# Altium project Enigma Rev A.PrjPCB (part 1 of 10)
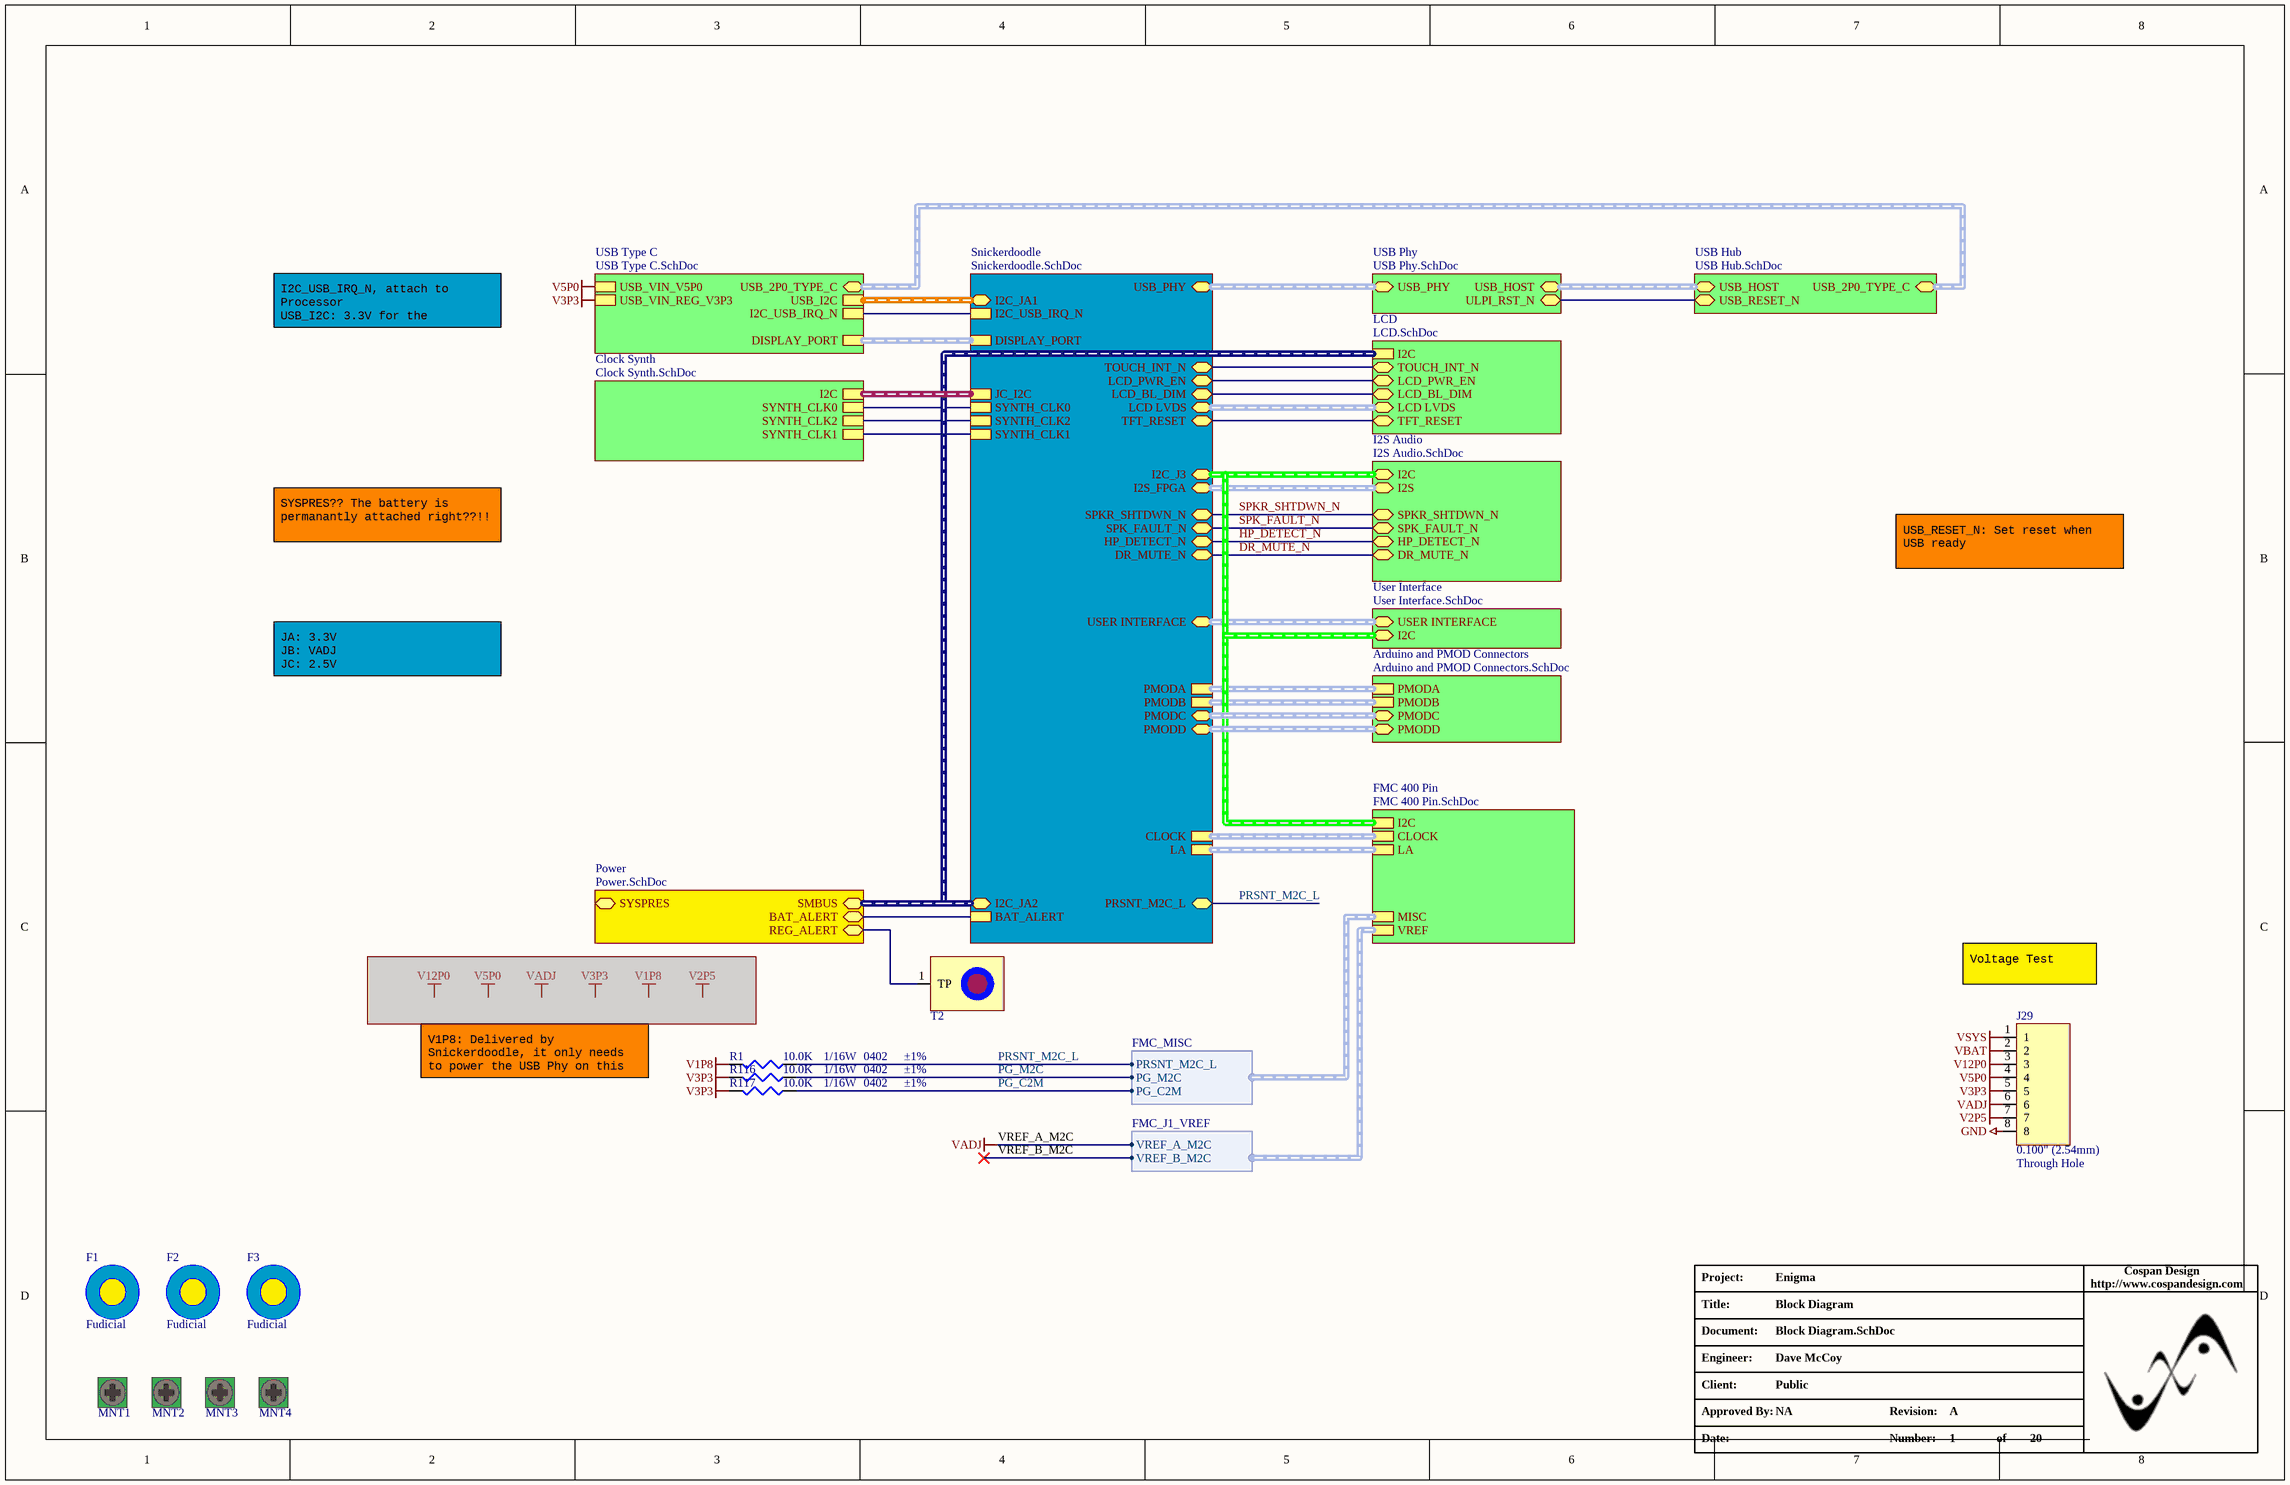
[diagram p0: Block Diagram.SchDoc]
Company: Cospan Design LLC; DrawnBy: Dave McCoy; Engineer: Dave McCoy; Project: Enigma; Revision: A
20 sheets, 563 parts. Net scope: hierarchical (ports join the sheet entries above them; power ports are global).
Board file: Enigma Rev A.PcbDoc
Sheets:
  Block Diagram.SchDoc
    Arduino and PMOD Connectors = Arduino and PMOD Connectors.SchDoc
    User Interface = User Interface.SchDoc
    Snickerdoodle = Snickerdoodle.SchDoc
      Snickerdoodle PS = Snickerdoodle PS.SchDoc
      Snickerdoodle FPGA JA = Snickerdoodle FPGA JA.SchDoc
      Snickerdoodle FPGA JB = Snickerdoodle FPGA JB.SchDoc
      Snickerdoodle FPGA JC = Snickerdoodle FPGA JC.SchDoc
    LCD = LCD.SchDoc
    USB Type C = USB Type C.SchDoc
      USB Type C Connector ESD.SchDoc = USB Type C Connector ESD.SchDoc
    USB Hub = USB Hub.SchDoc
    I2S Audio = I2S Audio.SchDoc
    USB Phy = USB Phy.SchDoc
    FMC 400 Pin = FMC 400 Pin.SchDoc
    Power = Power.SchDoc
      Battery Manager = Battery Manager.SchDoc
      Power V12P0 = Power V12P0.SchDoc
      Power Main Regulators = Power Main Regulators.SchDoc
    Clock Synth = Clock Synth.SchDoc

## Sheet Block Diagram.SchDoc: Block Diagram
size Tabloid; ApprovedBy: NA; CompanyName: Cospan Design LLC; DrawnBy: Dave McCoy; Engineer: Dave McCoy; DocumentNumber: 1; Revision: A; SheetNumber: 1; SheetTotal: 20; Client: Public; Project: Enigma; ProjectPrettyName: Enigma

### Parts
F1  Fudicial  [FIDUCIAL ROUND]  (no BOM)
F2  Fudicial  [FIDUCIAL ROUND]  (no BOM)
F3  Fudicial  [FIDUCIAL ROUND]  (no BOM)
J29  Pitch: 0.100" (2.54mm)  Mounting Type: Through Hole  [HDR_1X8 - FEMALE]  (hidden comment: J_HDR1X8_THRHOLE_VERT_RECPT)
MNT1  Mounting Hole  [MNT_4-40]  (value not drawn)  (no BOM)
MNT2  Mounting Hole  [MNT_4-40]  (value not drawn)  (no BOM)
MNT3  Mounting Hole  [MNT_4-40]  (value not drawn)  (no BOM)
MNT4  Mounting Hole  [MNT_4-40]  (value not drawn)  (no BOM)
R1  Resistance In Ohms: 10.0K  Power (Watts): 1/16W  Case: 0402  Tolerance: ±1%  [R_0402]  (hidden comment: R_0402_10.0K)
R116  Resistance In Ohms: 10.0K  Power (Watts): 1/16W  Case: 0402  Tolerance: ±1%  [R_0402]  (hidden comment: R_0402_10.0K)
R117  Resistance In Ohms: 10.0K  Power (Watts): 1/16W  Case: 0402  Tolerance: ±1%  [R_0402]  (hidden comment: R_0402_10.0K)
T2  TEST_POINT_SMALL  [TestPointSmall]  (value not drawn)  (no BOM)

### Sub-sheets
Arduino and PMOD Connectors = Arduino and PMOD Connectors.SchDoc: PMODA (harness PMOD_Harness), PMODB (harness PMOD_Harness), PMODC (harness PMOD_Harness), PMODD (harness PMOD_Harness)
Clock Synth = Clock Synth.SchDoc: I2C (harness I2C Harness), SYNTH_CLK0, SYNTH_CLK2, SYNTH_CLK1
FMC 400 Pin = FMC 400 Pin.SchDoc: LA (harness FMC_J1_LA), MISC (harness FMC_MISC), I2C (harness I2C Harness), CLOCK (harness FMC_J1_CLOCK), VREF (harness FMC_J1_VREF)
I2S Audio = I2S Audio.SchDoc: SPKR_SHTDWN_N, I2C (harness I2C Harness), I2S (harness I2S Harness), DR_MUTE_N, SPK_FAULT_N, HP_DETECT_N
LCD = LCD.SchDoc: LCD LVDS (harness LCD Harness), TFT_RESET, I2C (harness I2C Harness), LCD_PWR_EN, LCD_BL_DIM, TOUCH_INT_N
Power = Power.SchDoc: SMBUS (harness I2C Harness), SYSPRES, BAT_ALERT, REG_ALERT
Snickerdoodle = Snickerdoodle.SchDoc: I2S_FPGA (harness I2S Harness), SPKR_SHTDWN_N, DR_MUTE_N, SPK_FAULT_N, HP_DETECT_N, USB_PHY (harness USB Phy Harness), I2C_USB_IRQ_N, DISPLAY_PORT (harness Display Port), USER INTERFACE (harness User Interface Harness), PMODA (harness PMOD_Harness), PMODB (harness PMOD_Harness), BAT_ALERT, LA (harness FMC_J1_LA), CLOCK (harness FMC_J1_CLOCK), PMODC (harness PMOD_Harness), PMODD (harness PMOD_Harness), SYNTH_CLK0, SYNTH_CLK2, SYNTH_CLK1, JC_I2C (harness I2C Harness), I2C_JA1 (harness I2C Harness), LCD LVDS (harness LCD Harness), I2C_J3 (harness I2C Harness), I2C_JA2 (harness I2C Harness), TFT_RESET, LCD_PWR_EN, LCD_BL_DIM, TOUCH_INT_N, PRSNT_M2C_L
USB Hub = USB Hub.SchDoc: USB_HOST (harness USB Harness), USB_RESET_N, USB_2P0_TYPE_C (harness USB Harness)
USB Phy = USB Phy.SchDoc: USB_PHY (harness USB Phy Harness), USB_HOST (harness USB Harness), ULPI_RST_N
USB Type C = USB Type C.SchDoc: I2C_USB_IRQ_N, USB_VIN_REG_V3P3, DISPLAY_PORT (harness Display Port), USB_VIN_V5P0, USB_I2C (harness I2C Harness), USB_2P0_TYPE_C (harness USB Harness)
User Interface = User Interface.SchDoc: USER INTERFACE (harness User Interface Harness), I2C (harness I2C Harness)

### Harnesses
FMC_J1_VREF: VREF_A_M2C, VREF_B_M2C
FMC_MISC: PRSNT_M2C_L, PG_M2C, PG_C2M

### Nets
GND: J29.8
V1P8: R1.1
V2P5: J29.7
V3P3: J29.5 R116.1 R117.1 ; sheet USB Type C/USB_VIN_REG_V3P3
V5P0: J29.4 ; sheet USB Type C/USB_VIN_V5P0
V12P0: J29.3
VADJ: J29.6 ; sheet FMC 400 Pin/VREF.VREF_A_M2C  [also labelled VREF_A_M2C]
VBAT: J29.2
VSYS: J29.1
ALERT: sheet Snickerdoodle/BAT_ALERT, sheet Power/BAT_ALERT
DR_MUTE_N: sheet Snickerdoodle/DR_MUTE_N, sheet I2S Audio/DR_MUTE_N
HP_DETECT_N: sheet Snickerdoodle/HP_DETECT_N, sheet I2S Audio/HP_DETECT_N
I2C_USB_IRQ_N: sheet Snickerdoodle/I2C_USB_IRQ_N, sheet USB Type C/I2C_USB_IRQ_N
LCD_BL_DIM: sheet Snickerdoodle/LCD_BL_DIM, sheet LCD/LCD_BL_DIM
LCD_PWR_EN: sheet Snickerdoodle/LCD_PWR_EN, sheet LCD/LCD_PWR_EN
PG_C2M: R117.2 ; sheet FMC 400 Pin/MISC.PG_C2M
PG_M2C: R116.2 ; sheet FMC 400 Pin/MISC.PG_M2C
PRSNT_M2C_L: R1.2 ; sheet Snickerdoodle/PRSNT_M2C_L, sheet FMC 400 Pin/MISC.PRSNT_M2C_L
SPK_FAULT_N: sheet Snickerdoodle/SPK_FAULT_N, sheet I2S Audio/SPK_FAULT_N
SPKR_SHTDWN_N: sheet Snickerdoodle/SPKR_SHTDWN_N, sheet I2S Audio/SPKR_SHTDWN_N
SYNTH_CLK0: sheet Snickerdoodle/SYNTH_CLK0, sheet Clock Synth/SYNTH_CLK0
SYNTH_CLK1: sheet Snickerdoodle/SYNTH_CLK1, sheet Clock Synth/SYNTH_CLK1
SYNTH_CLK2: sheet Snickerdoodle/SYNTH_CLK2, sheet Clock Synth/SYNTH_CLK2
TFT_RESET: sheet Snickerdoodle/TFT_RESET, sheet LCD/TFT_RESET
TOUCH_INT_N: sheet Snickerdoodle/TOUCH_INT_N, sheet LCD/TOUCH_INT_N
ULPI_RST_N: sheet USB Hub/USB_RESET_N, sheet USB Phy/ULPI_RST_N
NetT2_1: T2.1(TP) ; sheet Power/REG_ALERT

### Buses and harness runs
harness sheet Arduino and PMOD Connectors/PMODA = sheet Snickerdoodle/PMODA
harness sheet Arduino and PMOD Connectors/PMODB = sheet Snickerdoodle/PMODB
harness sheet Arduino and PMOD Connectors/PMODC = sheet Snickerdoodle/PMODC
harness sheet Arduino and PMOD Connectors/PMODD = sheet Snickerdoodle/PMODD
harness sheet Clock Synth/I2C = sheet Snickerdoodle/JC_I2C
harness sheet FMC 400 Pin/CLOCK = sheet Snickerdoodle/CLOCK
harness sheet FMC 400 Pin/I2C = sheet I2S Audio/I2C = sheet Snickerdoodle/I2C_J3 = sheet User Interface/I2C
harness sheet FMC 400 Pin/LA = sheet Snickerdoodle/LA
harness sheet I2S Audio/I2S = sheet Snickerdoodle/I2S_FPGA
harness sheet LCD/I2C = sheet Power/SMBUS = sheet Snickerdoodle/I2C_JA2
harness sheet LCD/LCD LVDS = sheet Snickerdoodle/LCD LVDS
harness sheet Snickerdoodle/DISPLAY_PORT = sheet USB Type C/DISPLAY_PORT
harness sheet Snickerdoodle/I2C_JA1 = sheet USB Type C/USB_I2C
harness sheet Snickerdoodle/USB_PHY = sheet USB Phy/USB_PHY
harness sheet Snickerdoodle/USER INTERFACE = sheet User Interface/USER INTERFACE
harness sheet USB Hub/USB_2P0_TYPE_C = sheet USB Type C/USB_2P0_TYPE_C
harness sheet USB Hub/USB_HOST = sheet USB Phy/USB_HOST

### Notes on the sheet
- I2C_USB_IRQ_N, attach to Processor
  USB_I2C: 3.3V for the Processor
- SYSPRES?? The battery is permanantly attached right??!!
- USB_RESET_N: Set reset when USB ready
- JA: 3.3V
  JB: VADJ
  JC: 2.5V
- Voltage Test
- V1P8: Delivered by Snickerdoodle, it only needs to power the USB Phy on this board
- Project:
- http://www.cospandesign.com
- Cospan Design
- Document:
- Engineer:
- Title:
- Client:
- Approved By:
- Revision:
- Date:
- Number:
- of

### Library data of the parts
F1-F3 = F_FUDICIAL
J29 = J_HDR1X8_THRHOLE_VERT_FEMALE: CONN HEADER FEMALE 8POS .1" TIN; Manufacturer: Samtec; Manufacturer Part Number: SSW-108-01-T-S; Number of Positions: 8; Number of Positions Loaded: All; Supplier 1: Samtec; Supplier Part Number 1: SSW-108-01-T-S; RoHS: RoHS Compliant; Category: Connectors, Interconnects; Connector Type: Header; Contact Type: Female Socket; Number of Rows: 1; Termination: Solder; Fastening Type: -; Features: -; Contact Finish: Tin; Contact Finish Thickness: -; Color: Black; ComponentLink1URL: http://www.sullinscorp.com/drawings/101_xPxCxxxLFBN-RC,_10492-D.pdf; ComponentLink1Description: http://www.sullinscorp.com/drawings/101_xPxCxxxLFBN-RC,_10492-D.pdf; Pricing: 1=0.497
MNT1-MNT4 = MNT_440_HOLE
R1 R116 R117 = R_0402_10.0K: RES 10.0K OHM 1/16W 1% 0402 SMD; Manufacturer: Stackpole Electronics Inc; Manufacturer Part Number: RMCF0402FT10K0; Resistance (Ohms): 10k; Temperature Coefficient: ±100ppm/°C; Supplier 1: Digi-Key; Supplier Part Number 1: RMCF0402FT10K0CT-ND; RoHS: RoHS Compliant; Category: Resistors; Stock 1: 234525; Pricing: 1=0.04, 10=0.025, 50=0.0138, 100=0.0105, 250=0.0078, 500=0.00576, 1000=0.00384, 2500=0.00324, 5000=0.0027 (USD); Composition: Thick Film; Features: -; Package / Case: 0402 (1005 Metric); Size / Dimension: 0.039" L x 0.020" W (1.00mm x 0.50mm); Height: 0.016" (0.40mm); Number of Terminations: 2; Packaging: Cut Tape (CT); ComponentLink1URL: http://www.seielect.com/Catalog/SEI-RMCF_RMCP.pdf; ComponentLink1Description: http://www.seielect.com/Catalog/SEI-RMCF_RMCP.pdf
T2 = TEST_POINT_SMALL: OSCILLOSCOPE TEST POINT

## Sheet Arduino and PMOD Connectors.SchDoc: Low Speed Expansion
size Tabloid; Date: 7/17/2014; ApprovedBy: NA; CompanyName: Cospan Design LLC; DrawnBy: Dave McCoy; Engineer: Dave McCoy; DocumentNumber: 14; Revision: A; SheetNumber: 14; SheetTotal: 20; Client: Public; Project: Enigma; ProjectPrettyName: Enigma; ProjectName: Enigma
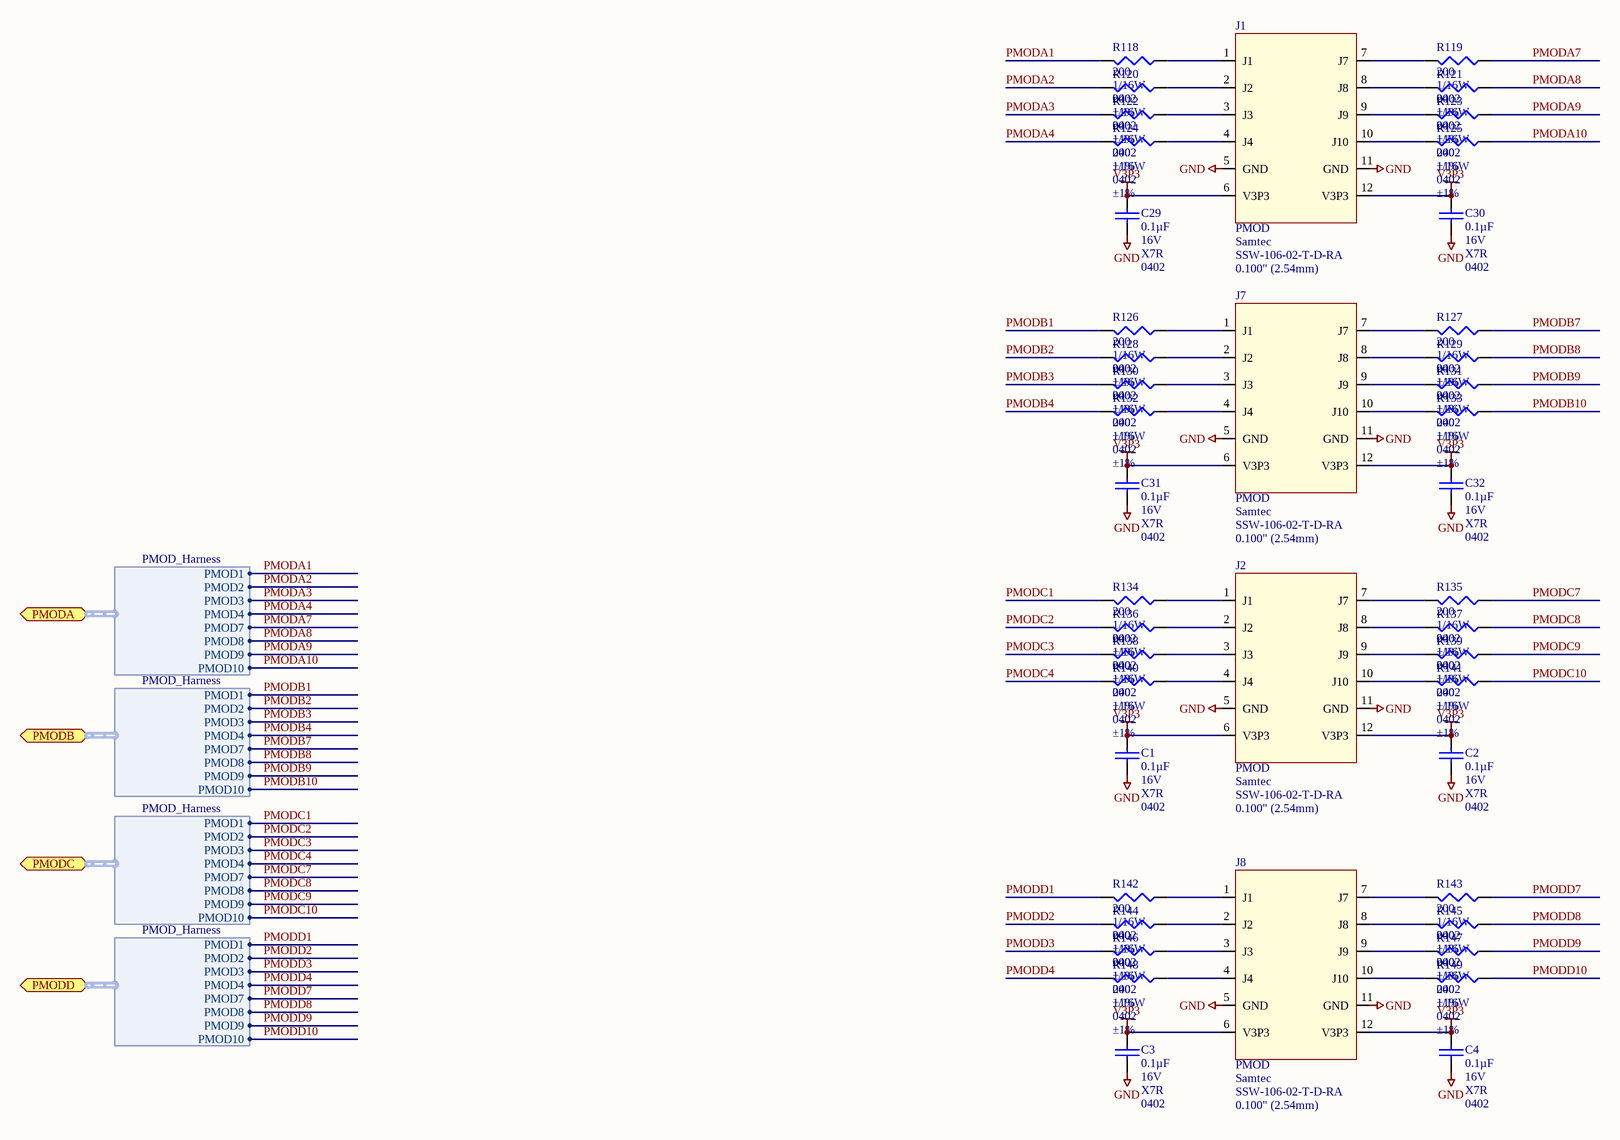
[diagram p1: Arduino and PMOD Connectors.SchDoc]

### Parts
C1  Capacitance: 0.1µF  Voltage - Rated: 16V  Temperature Coefficient: X7R  Package / Case: 0402  [C_0402]  (hidden comment: 0.1uF)
C2  Capacitance: 0.1µF  Voltage - Rated: 16V  Temperature Coefficient: X7R  Package / Case: 0402  [C_0402]  (hidden comment: 0.1uF)
C3  Capacitance: 0.1µF  Voltage - Rated: 16V  Temperature Coefficient: X7R  Package / Case: 0402  [C_0402]  (hidden comment: 0.1uF)
C4  Capacitance: 0.1µF  Voltage - Rated: 16V  Temperature Coefficient: X7R  Package / Case: 0402  [C_0402]  (hidden comment: 0.1uF)
C29  Capacitance: 0.1µF  Voltage - Rated: 16V  Temperature Coefficient: X7R  Package / Case: 0402  [C_0402]  (hidden comment: 0.1uF)
C30  Capacitance: 0.1µF  Voltage - Rated: 16V  Temperature Coefficient: X7R  Package / Case: 0402  [C_0402]  (hidden comment: 0.1uF)
C31  Capacitance: 0.1µF  Voltage - Rated: 16V  Temperature Coefficient: X7R  Package / Case: 0402  [C_0402]  (hidden comment: 0.1uF)
C32  Capacitance: 0.1µF  Voltage - Rated: 16V  Temperature Coefficient: X7R  Package / Case: 0402  [C_0402]  (hidden comment: 0.1uF)
J1  PMOD  Manufacturer: Samtec  Manufacturer Part Number: SSW-106-02-T-D-RA  Pitch: 0.100" (2.54mm)  [PMOD]
J2  PMOD  Manufacturer: Samtec  Manufacturer Part Number: SSW-106-02-T-D-RA  Pitch: 0.100" (2.54mm)  [PMOD]
J7  PMOD  Manufacturer: Samtec  Manufacturer Part Number: SSW-106-02-T-D-RA  Pitch: 0.100" (2.54mm)  [PMOD]
J8  PMOD  Manufacturer: Samtec  Manufacturer Part Number: SSW-106-02-T-D-RA  Pitch: 0.100" (2.54mm)  [PMOD]
R118  Resistance In Ohms: 200  Power (Watts): 1/16W  Case: 0402  Tolerance: ±1%  [R_0402]  (hidden comment: R_0402_200)
R119  Resistance In Ohms: 200  Power (Watts): 1/16W  Case: 0402  Tolerance: ±1%  [R_0402]  (hidden comment: R_0402_200)
R120  Resistance In Ohms: 200  Power (Watts): 1/16W  Case: 0402  Tolerance: ±1%  [R_0402]  (hidden comment: R_0402_200)
R121  Resistance In Ohms: 200  Power (Watts): 1/16W  Case: 0402  Tolerance: ±1%  [R_0402]  (hidden comment: R_0402_200)
R122  Resistance In Ohms: 200  Power (Watts): 1/16W  Case: 0402  Tolerance: ±1%  [R_0402]  (hidden comment: R_0402_200)
R123  Resistance In Ohms: 200  Power (Watts): 1/16W  Case: 0402  Tolerance: ±1%  [R_0402]  (hidden comment: R_0402_200)
R124  Resistance In Ohms: 200  Power (Watts): 1/16W  Case: 0402  Tolerance: ±1%  [R_0402]  (hidden comment: R_0402_200)
R125  Resistance In Ohms: 200  Power (Watts): 1/16W  Case: 0402  Tolerance: ±1%  [R_0402]  (hidden comment: R_0402_200)
R126  Resistance In Ohms: 200  Power (Watts): 1/16W  Case: 0402  Tolerance: ±1%  [R_0402]  (hidden comment: R_0402_200)
R127  Resistance In Ohms: 200  Power (Watts): 1/16W  Case: 0402  Tolerance: ±1%  [R_0402]  (hidden comment: R_0402_200)
R128  Resistance In Ohms: 200  Power (Watts): 1/16W  Case: 0402  Tolerance: ±1%  [R_0402]  (hidden comment: R_0402_200)
R129  Resistance In Ohms: 200  Power (Watts): 1/16W  Case: 0402  Tolerance: ±1%  [R_0402]  (hidden comment: R_0402_200)
R130  Resistance In Ohms: 200  Power (Watts): 1/16W  Case: 0402  Tolerance: ±1%  [R_0402]  (hidden comment: R_0402_200)
R131  Resistance In Ohms: 200  Power (Watts): 1/16W  Case: 0402  Tolerance: ±1%  [R_0402]  (hidden comment: R_0402_200)
R132  Resistance In Ohms: 200  Power (Watts): 1/16W  Case: 0402  Tolerance: ±1%  [R_0402]  (hidden comment: R_0402_200)
R133  Resistance In Ohms: 200  Power (Watts): 1/16W  Case: 0402  Tolerance: ±1%  [R_0402]  (hidden comment: R_0402_200)
R134  Resistance In Ohms: 200  Power (Watts): 1/16W  Case: 0402  Tolerance: ±1%  [R_0402]  (hidden comment: R_0402_200)
R135  Resistance In Ohms: 200  Power (Watts): 1/16W  Case: 0402  Tolerance: ±1%  [R_0402]  (hidden comment: R_0402_200)
R136  Resistance In Ohms: 200  Power (Watts): 1/16W  Case: 0402  Tolerance: ±1%  [R_0402]  (hidden comment: R_0402_200)
R137  Resistance In Ohms: 200  Power (Watts): 1/16W  Case: 0402  Tolerance: ±1%  [R_0402]  (hidden comment: R_0402_200)
R138  Resistance In Ohms: 200  Power (Watts): 1/16W  Case: 0402  Tolerance: ±1%  [R_0402]  (hidden comment: R_0402_200)
R139  Resistance In Ohms: 200  Power (Watts): 1/16W  Case: 0402  Tolerance: ±1%  [R_0402]  (hidden comment: R_0402_200)
R140  Resistance In Ohms: 200  Power (Watts): 1/16W  Case: 0402  Tolerance: ±1%  [R_0402]  (hidden comment: R_0402_200)
R141  Resistance In Ohms: 200  Power (Watts): 1/16W  Case: 0402  Tolerance: ±1%  [R_0402]  (hidden comment: R_0402_200)
R142  Resistance In Ohms: 200  Power (Watts): 1/16W  Case: 0402  Tolerance: ±1%  [R_0402]  (hidden comment: R_0402_200)
R143  Resistance In Ohms: 200  Power (Watts): 1/16W  Case: 0402  Tolerance: ±1%  [R_0402]  (hidden comment: R_0402_200)
R144  Resistance In Ohms: 200  Power (Watts): 1/16W  Case: 0402  Tolerance: ±1%  [R_0402]  (hidden comment: R_0402_200)
R145  Resistance In Ohms: 200  Power (Watts): 1/16W  Case: 0402  Tolerance: ±1%  [R_0402]  (hidden comment: R_0402_200)
R146  Resistance In Ohms: 200  Power (Watts): 1/16W  Case: 0402  Tolerance: ±1%  [R_0402]  (hidden comment: R_0402_200)
R147  Resistance In Ohms: 200  Power (Watts): 1/16W  Case: 0402  Tolerance: ±1%  [R_0402]  (hidden comment: R_0402_200)
R148  Resistance In Ohms: 200  Power (Watts): 1/16W  Case: 0402  Tolerance: ±1%  [R_0402]  (hidden comment: R_0402_200)
R149  Resistance In Ohms: 200  Power (Watts): 1/16W  Case: 0402  Tolerance: ±1%  [R_0402]  (hidden comment: R_0402_200)

### Ports
PMODA (harness PMOD_Harness), PMODB (harness PMOD_Harness), PMODC (harness PMOD_Harness), PMODD (harness PMOD_Harness)

### Harnesses
PMOD_Harness: PMOD1, PMOD2, PMOD3, PMOD4, PMOD7, PMOD8, PMOD9, PMOD10

### Nets
GND: C1.1 C2.1 C3.1 C4.1 C29.1 C30.1 C31.1 C32.1 J1.5(GND) J1.11(GND) J2.5(GND) J2.11(GND) J7.5(GND) J7.11(GND) J8.5(GND) J8.11(GND)
V3P3: C1.2 C2.2 C3.2 C4.2 C29.2 C30.2 C31.2 C32.2 J1.6(V3P3) J1.12(V3P3) J2.6(V3P3) J2.12(V3P3) J7.6(V3P3) J7.12(V3P3) J8.6(V3P3) J8.12(V3P3)
PMODA1: R118.1 ; port PMODA.PMOD1
PMODA2: R120.1 ; port PMODA.PMOD2
PMODA3: R122.1 ; port PMODA.PMOD3
PMODA4: R124.1 ; port PMODA.PMOD4
PMODA7: R119.2 ; port PMODA.PMOD7
PMODA8: R121.2 ; port PMODA.PMOD8
PMODA9: R123.2 ; port PMODA.PMOD9
PMODA10: R125.2 ; port PMODA.PMOD10
PMODB1: R126.1 ; port PMODB.PMOD1
PMODB2: R128.1 ; port PMODB.PMOD2
PMODB3: R130.1 ; port PMODB.PMOD3
PMODB4: R132.1 ; port PMODB.PMOD4
PMODB7: R127.2 ; port PMODB.PMOD7
PMODB8: R129.2 ; port PMODB.PMOD8
PMODB9: R131.2 ; port PMODB.PMOD9
PMODB10: R133.2 ; port PMODB.PMOD10
PMODC1: R134.1 ; port PMODC.PMOD1
PMODC2: R136.1 ; port PMODC.PMOD2
PMODC3: R138.1 ; port PMODC.PMOD3
PMODC4: R140.1 ; port PMODC.PMOD4
PMODC7: R135.2 ; port PMODC.PMOD7
PMODC8: R137.2 ; port PMODC.PMOD8
PMODC9: R139.2 ; port PMODC.PMOD9
PMODC10: R141.2 ; port PMODC.PMOD10
PMODD1: R142.1 ; port PMODD.PMOD1
PMODD2: R144.1 ; port PMODD.PMOD2
PMODD3: R146.1 ; port PMODD.PMOD3
PMODD4: R148.1 ; port PMODD.PMOD4
PMODD7: R143.2 ; port PMODD.PMOD7
PMODD8: R145.2 ; port PMODD.PMOD8
PMODD9: R147.2 ; port PMODD.PMOD9
PMODD10: R149.2 ; port PMODD.PMOD10
NetJ1_1: J1.1(J1) R118.2
NetJ1_2: J1.2(J2) R120.2
NetJ1_3: J1.3(J3) R122.2
NetJ1_4: J1.4(J4) R124.2
NetJ1_7: J1.7(J7) R119.1
NetJ1_8: J1.8(J8) R121.1
NetJ1_9: J1.9(J9) R123.1
NetJ1_10: J1.10(J10) R125.1
NetJ2_1: J2.1(J1) R134.2
NetJ2_2: J2.2(J2) R136.2
NetJ2_3: J2.3(J3) R138.2
NetJ2_4: J2.4(J4) R140.2
NetJ2_7: J2.7(J7) R135.1
NetJ2_8: J2.8(J8) R137.1
NetJ2_9: J2.9(J9) R139.1
NetJ2_10: J2.10(J10) R141.1
NetJ7_1: J7.1(J1) R126.2
NetJ7_2: J7.2(J2) R128.2
NetJ7_3: J7.3(J3) R130.2
NetJ7_4: J7.4(J4) R132.2
NetJ7_7: J7.7(J7) R127.1
NetJ7_8: J7.8(J8) R129.1
NetJ7_9: J7.9(J9) R131.1
NetJ7_10: J7.10(J10) R133.1
NetJ8_1: J8.1(J1) R142.2
NetJ8_2: J8.2(J2) R144.2
NetJ8_3: J8.3(J3) R146.2
NetJ8_4: J8.4(J4) R148.2
NetJ8_7: J8.7(J7) R143.1
NetJ8_8: J8.8(J8) R145.1
NetJ8_9: J8.9(J9) R147.1
NetJ8_10: J8.10(J10) R149.1

### Notes on the sheet
- Title:
- http://www.cospandesign.com
- Cospan Design
- Project:
- Document:
- Engineer:
- Revision:
- Drawn By:
- Date:
- Number:
- of

### Library data of the parts
C1-C4 C29-C32 = C_0402_0.1UF_16V: CAP CER .10UF 16V X7R 0402; Manufacturer: Murata Electronics North America; Manufacturer Part Number: GRM155R71C104KA88J; Tolerance: ±10%; Description: CAP CER 0.1UF 16V X7R 0402; Supplier 1: Digi-Key; Supplier Part Number 1: 490-6328-1-ND; RoHS: RoHS Compliant; Category: Capacitors; Stock 1: 18103134; Mounting Type: Surface Mount, MLCC; Features: -; Lead Spacing: -; Packaging: Cut Tape (CT); ComponentLink1URL: http://www.murata.com/~/media/webrenewal/support/library/catalog/products/capacitor/mlcc/c02e.ashx?la=en-us; ComponentLink1Description: http://www.murata.com/~/media/webrenewal/support/library/catalog/products/capacitor/mlcc/c02e.ashx?la=en-us; Operating Temperature: -55°C ~ 125°C; Pricing 1: 1=0.1, 10=0.014, 100=0.0062, 500=0.00442, 1000=0.00348, 2500=0.00316, 5000=0.00291 (USD); Part Status: Active; Ratings: -; Applications: General Purpose; Size / Dimension: 0.039" L x 0.020" W (1.00mm x 0.50mm); Height - Seated (Max): -; Thickness (Max): 0.022" (0.55mm)
J1 J2 J7 J8 = J_PMOD: CONN FEMALE 12POS DL .1" R/A TIN; Connector Type: Header; Number of Positions: 12; Number of Positions Loaded: All; Supplier 1: Samtec; Supplier Part Number 1: SSW-106-02-T-D-RA; Category: Connectors, Interconnects; Stock 1: 890; Contact Type: Female Socket; Number of Rows: 2; Row Spacing: 0.100" (2.54mm); Mounting Type: Through Hole, Right Angle; Termination: Solder; Fastening Type: -; Features: -; Contact Finish: Tin; Contact Finish Thickness: -; Color: Black; ComponentLink1URL: http://www.sullinscorp.com/drawings/101_xPxCxx2LJBN-RC,_10494-C.pdf; ComponentLink1Description: http://www.sullinscorp.com/drawings/101_xPxCxx2LJBN-RC,_10494-C.pdf; Pricing: 1=0.723
R118-R149 = R_0402_200: RES 200 OHM 1/10W 1% 0402 SMD; Manufacturer: Panasonic Electronic Components; Manufacturer Part Number: ERJ-2RKF2000X; Temperature Coefficient: ±100ppm/°C; Description: RES SMD 200 OHM 1% 1/10W 0402; Supplier 1: Digi-Key; RoHS: RoHS Compliant; Category: Resistors; Stock 1: 1082421; Pricing 1: 1=0.1, 10=0.028, 100=0.0113, 1000=0.00509, 2500=0.00442, 5000=0.00365 (USD); Composition: Thick Film; Features: Automotive AEC-Q200; Package / Case: 0402 (1005 Metric); Supplier Device Package: 0402; Size / Dimension: 0.039" L x 0.020" W (1.00mm x 0.50mm); Packaging: Cut Tape (CT); ComponentLink1URL: https://industrial.panasonic.com/cdbs/www-data/pdf/RDA0000/AOA0000C304.pdf; ComponentLink1Description: https://industrial.panasonic.com/cdbs/www-data/pdf/RDA0000/AOA0000C304.pdf; Supplier Part Number 1: P200LCT-ND; Part Status: Active; Operating Temperature: -55°C ~ 155°C; Height - Seated (Max): 0.016" (0.40mm); Failure Rate: -

## Sheet User Interface.SchDoc: Buttons/LEDs
size Tabloid; ApprovedBy: NA; CompanyName: Cospan Design LLC; DrawnBy: Dave McCoy; Engineer: Dave McCoy; DocumentNumber: 15; Revision: A; SheetNumber: 15; SheetTotal: 20; Client: Public; Project: Enigma; ProjectPrettyName: Enigma
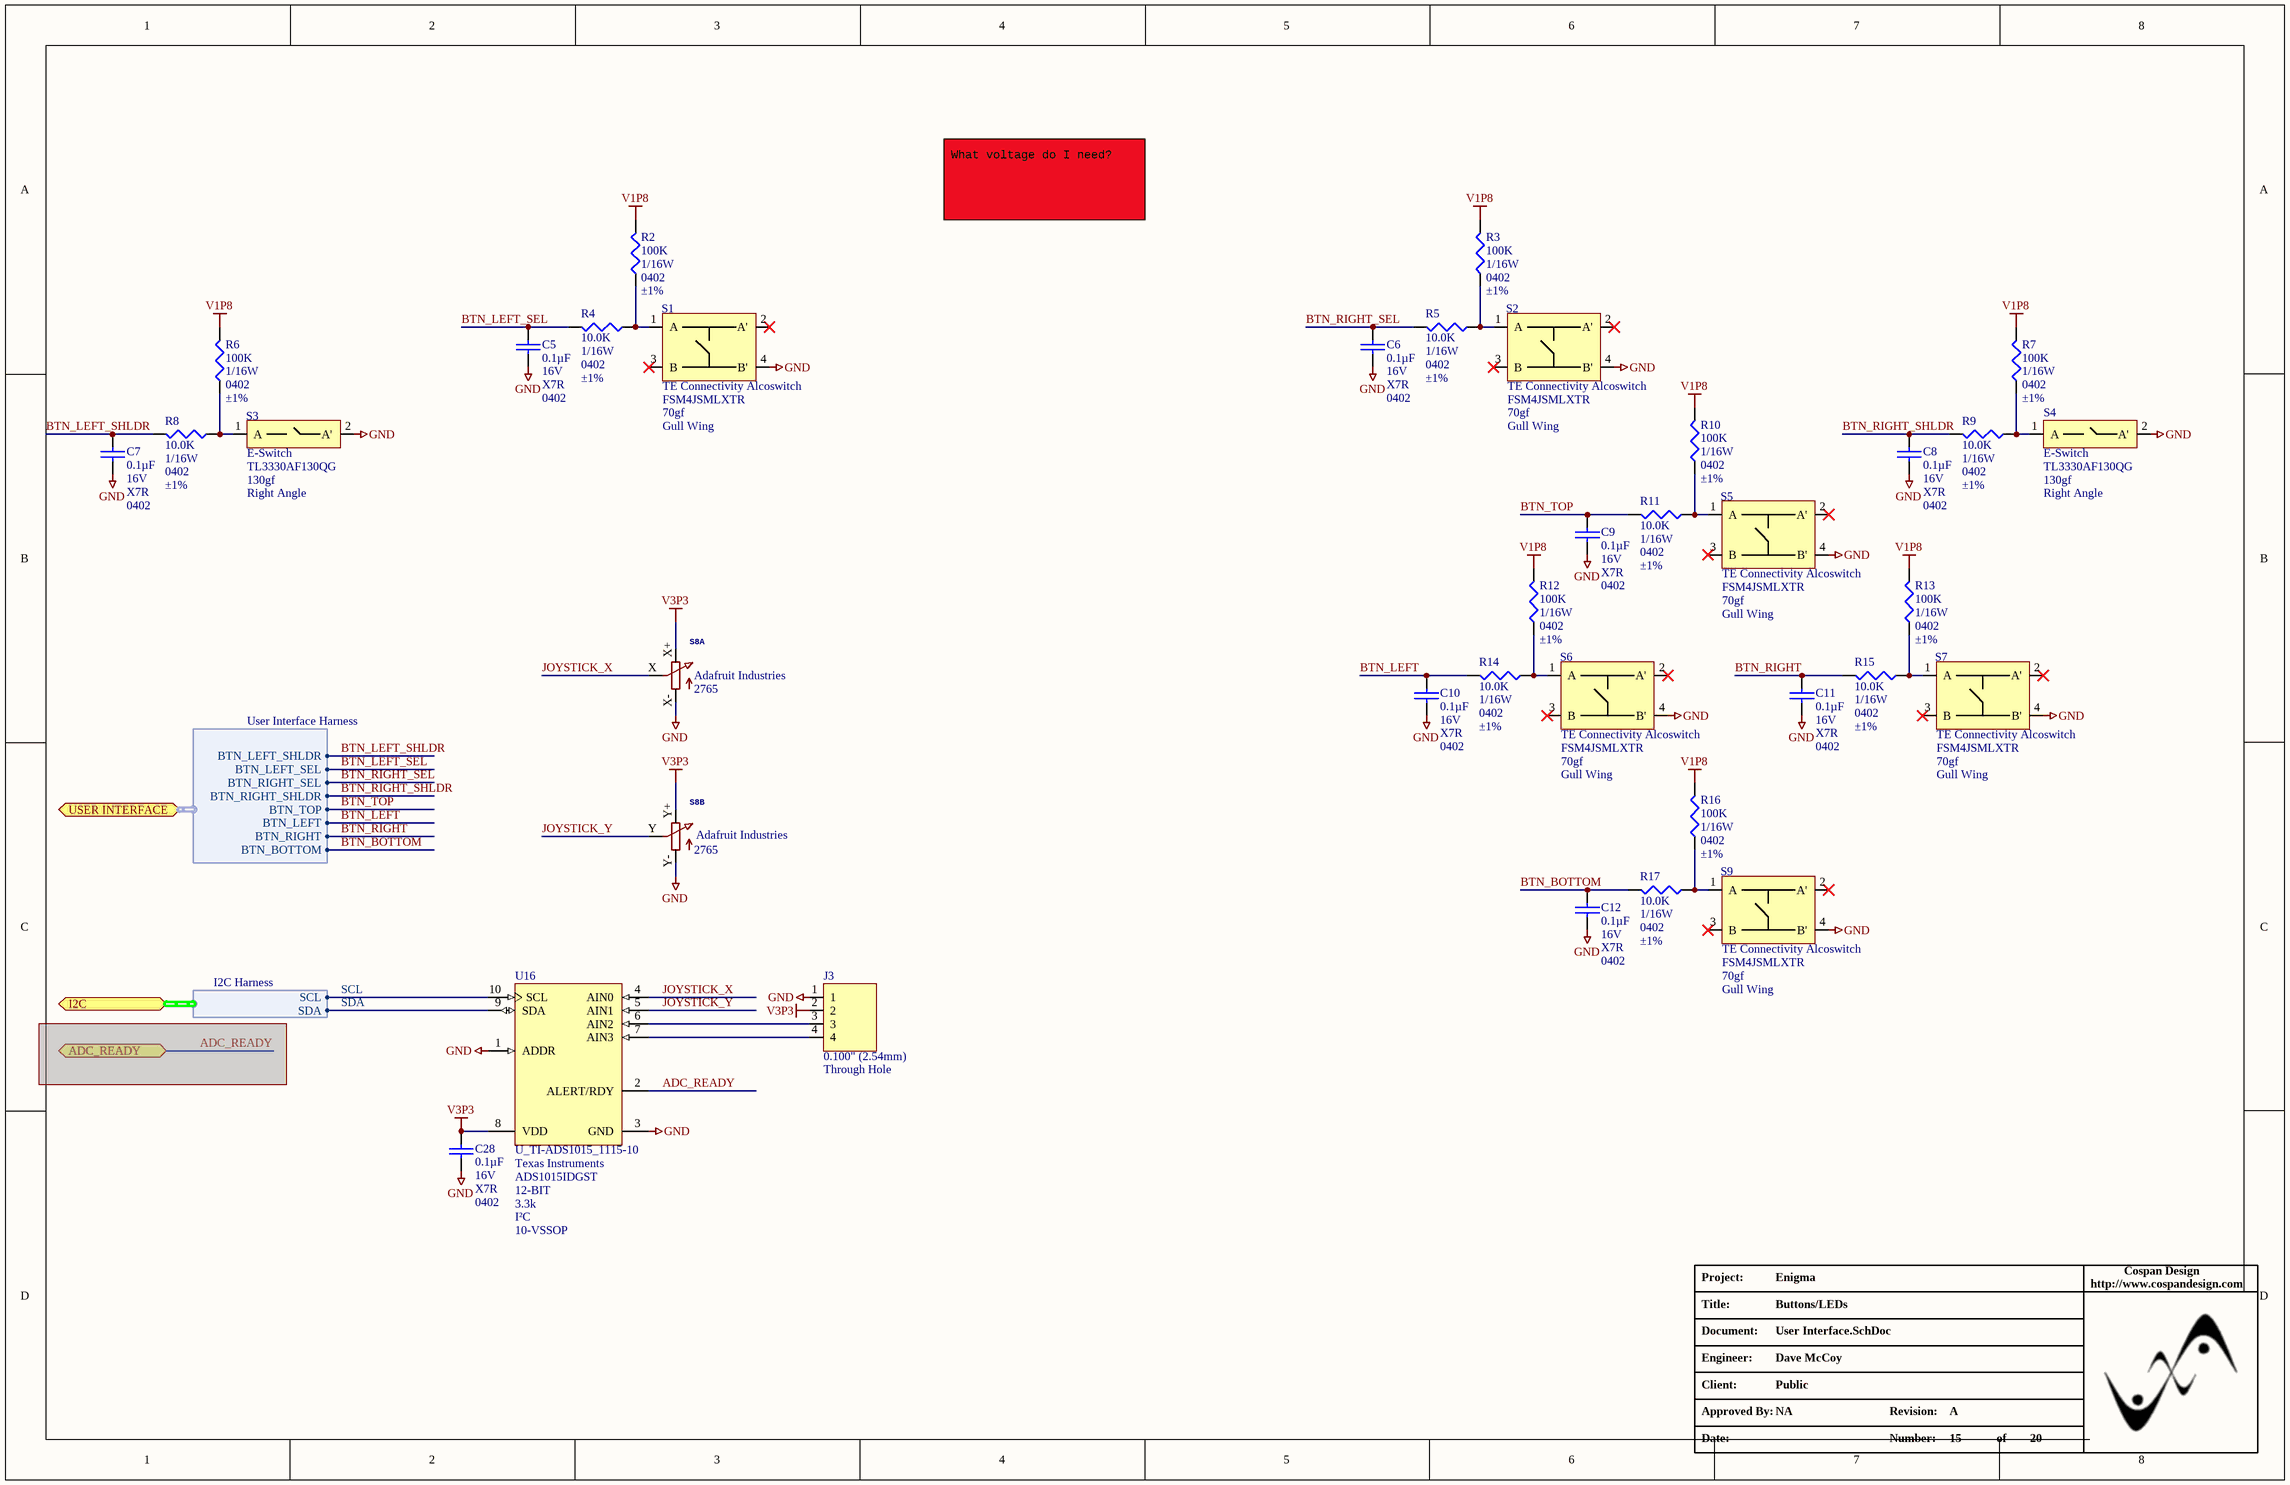
[diagram p2: User Interface.SchDoc]

### Parts
C5  Capacitance: 0.1µF  Voltage - Rated: 16V  Temperature Coefficient: X7R  Package / Case: 0402  [C_0402]  (hidden comment: 0.1uF)
C6  Capacitance: 0.1µF  Voltage - Rated: 16V  Temperature Coefficient: X7R  Package / Case: 0402  [C_0402]  (hidden comment: 0.1uF)
C7  Capacitance: 0.1µF  Voltage - Rated: 16V  Temperature Coefficient: X7R  Package / Case: 0402  [C_0402]  (hidden comment: 0.1uF)
C8  Capacitance: 0.1µF  Voltage - Rated: 16V  Temperature Coefficient: X7R  Package / Case: 0402  [C_0402]  (hidden comment: 0.1uF)
C9  Capacitance: 0.1µF  Voltage - Rated: 16V  Temperature Coefficient: X7R  Package / Case: 0402  [C_0402]  (hidden comment: 0.1uF)
C10  Capacitance: 0.1µF  Voltage - Rated: 16V  Temperature Coefficient: X7R  Package / Case: 0402  [C_0402]  (hidden comment: 0.1uF)
C11  Capacitance: 0.1µF  Voltage - Rated: 16V  Temperature Coefficient: X7R  Package / Case: 0402  [C_0402]  (hidden comment: 0.1uF)
C12  Capacitance: 0.1µF  Voltage - Rated: 16V  Temperature Coefficient: X7R  Package / Case: 0402  [C_0402]  (hidden comment: 0.1uF)
C28  Capacitance: 0.1µF  Voltage - Rated: 16V  Temperature Coefficient: X7R  Package / Case: 0402  [C_0402]  (hidden comment: 0.1uF)
J3  Pitch: 0.100" (2.54mm)  Mounting Type: Through Hole  [HDR_1X4_FEMALE]  (hidden comment: J_HDR1X4_THRHOLE_VERT_FEMALE)
R2  Resistance In Ohms: 100K  Power (Watts): 1/16W  Case: 0402  Tolerance: ±1%  [R_0402]  (hidden comment: R_0402_100K)
R3  Resistance In Ohms: 100K  Power (Watts): 1/16W  Case: 0402  Tolerance: ±1%  [R_0402]  (hidden comment: R_0402_100K)
R4  Resistance In Ohms: 10.0K  Power (Watts): 1/16W  Case: 0402  Tolerance: ±1%  [R_0402]  (hidden comment: R_0402_10.0K)
R5  Resistance In Ohms: 10.0K  Power (Watts): 1/16W  Case: 0402  Tolerance: ±1%  [R_0402]  (hidden comment: R_0402_10.0K)
R6  Resistance In Ohms: 100K  Power (Watts): 1/16W  Case: 0402  Tolerance: ±1%  [R_0402]  (hidden comment: R_0402_100K)
R7  Resistance In Ohms: 100K  Power (Watts): 1/16W  Case: 0402  Tolerance: ±1%  [R_0402]  (hidden comment: R_0402_100K)
R8  Resistance In Ohms: 10.0K  Power (Watts): 1/16W  Case: 0402  Tolerance: ±1%  [R_0402]  (hidden comment: R_0402_10.0K)
R9  Resistance In Ohms: 10.0K  Power (Watts): 1/16W  Case: 0402  Tolerance: ±1%  [R_0402]  (hidden comment: R_0402_10.0K)
R10  Resistance In Ohms: 100K  Power (Watts): 1/16W  Case: 0402  Tolerance: ±1%  [R_0402]  (hidden comment: R_0402_100K)
R11  Resistance In Ohms: 10.0K  Power (Watts): 1/16W  Case: 0402  Tolerance: ±1%  [R_0402]  (hidden comment: R_0402_10.0K)
R12  Resistance In Ohms: 100K  Power (Watts): 1/16W  Case: 0402  Tolerance: ±1%  [R_0402]  (hidden comment: R_0402_100K)
R13  Resistance In Ohms: 100K  Power (Watts): 1/16W  Case: 0402  Tolerance: ±1%  [R_0402]  (hidden comment: R_0402_100K)
R14  Resistance In Ohms: 10.0K  Power (Watts): 1/16W  Case: 0402  Tolerance: ±1%  [R_0402]  (hidden comment: R_0402_10.0K)
R15  Resistance In Ohms: 10.0K  Power (Watts): 1/16W  Case: 0402  Tolerance: ±1%  [R_0402]  (hidden comment: R_0402_10.0K)
R16  Resistance In Ohms: 100K  Power (Watts): 1/16W  Case: 0402  Tolerance: ±1%  [R_0402]  (hidden comment: R_0402_100K)
R17  Resistance In Ohms: 10.0K  Power (Watts): 1/16W  Case: 0402  Tolerance: ±1%  [R_0402]  (hidden comment: R_0402_10.0K)
S1  Manufacturer: TE Connectivity Alcoswitch  Manufacturer Part Number: FSM4JSMLXTR  Operating Force: 70gf  Termination: Gull Wing  [TACTILE_1571563_2]  (hidden comment: S_TACTILE_1571563_2_BUTTON)
S2  Manufacturer: TE Connectivity Alcoswitch  Manufacturer Part Number: FSM4JSMLXTR  Operating Force: 70gf  Termination: Gull Wing  [TACTILE_1571563_2]  (hidden comment: S_TACTILE_1571563_2_BUTTON)
S3  Manufacturer: E-Switch  Operating Force: 130gf  Orientation: Right Angle  [TL3330AF130QG]  (hidden comment: S_TACTILE_ RA_TL3330AF130QG_BUTTON)
S4  Manufacturer: E-Switch  Operating Force: 130gf  Orientation: Right Angle  [TL3330AF130QG]  (hidden comment: S_TACTILE_ RA_TL3330AF130QG_BUTTON)
S5  Manufacturer: TE Connectivity Alcoswitch  Manufacturer Part Number: FSM4JSMLXTR  Operating Force: 70gf  Termination: Gull Wing  [TACTILE_1571563_2]  (hidden comment: S_TACTILE_1571563_2_BUTTON)
S6  Manufacturer: TE Connectivity Alcoswitch  Manufacturer Part Number: FSM4JSMLXTR  Operating Force: 70gf  Termination: Gull Wing  [TACTILE_1571563_2]  (hidden comment: S_TACTILE_1571563_2_BUTTON)
S7  Manufacturer: TE Connectivity Alcoswitch  Manufacturer Part Number: FSM4JSMLXTR  Operating Force: 70gf  Termination: Gull Wing  [TACTILE_1571563_2]  (hidden comment: S_TACTILE_1571563_2_BUTTON)
S8  Manufacturer: Adafruit Industries  Manufacturer Part Number: 2765  [JOYSTICK_ANALOG_MINITHM]  (hidden comment: S_JOYSTICK_ANALOG_XY)  (parts A,B of 2)
S9  Manufacturer: TE Connectivity Alcoswitch  Manufacturer Part Number: FSM4JSMLXTR  Operating Force: 70gf  Termination: Gull Wing  [TACTILE_1571563_2]  (hidden comment: S_TACTILE_1571563_2_BUTTON)
U16  U_TI-ADS1015_1115-10  Manufacturer: Texas Instruments  Manufacturer Part Number: ADS1015IDGST  Number of Bits: 12-BIT  Sampling Rate (Per Second): 3.3k  Data Interface: I²C  Supplier Device Package: 10-VSSOP  [TI-DGS10_L]

### Ports
ADC_READY, I2C (harness I2C Harness), USER INTERFACE (harness User Interface Harness)

### Harnesses
User Interface Harness: BTN_LEFT_SHLDR, BTN_LEFT_SEL, BTN_RIGHT_SEL, BTN_RIGHT_SHLDR, BTN_TOP, BTN_LEFT, BTN_RIGHT, BTN_BOTTOM
I2C Harness: SCL, SDA

### Nets
GND: C5.1 C6.1 C7.1 C8.1 C9.1 C10.1 C11.1 C12.1 C28.1 J3.1 S1.4(B') S2.4(B') S3.2(A') S4.2(A') S5.4(B') S6.4(B') S7.4(B') S8.X-(A) S8.Y-(A) S9.4(B') U16.1(ADDR) U16.3(GND)
V1P8: R2.1 R3.1 R6.1 R7.1 R10.1 R12.1 R13.1 R16.1
V3P3: C28.2 J3.2 S8.X+(E) S8.Y+(E) U16.8(VDD)
ADC_READY: U16.2(ALERT/RDY)
BTN_BOTTOM: C12.2 R17.1 ; port USER INTERFACE.BTN_BOTTOM
BTN_LEFT: C10.2 R14.1 ; port USER INTERFACE.BTN_LEFT
BTN_LEFT_SEL: C5.2 R4.1 ; port USER INTERFACE.BTN_LEFT_SEL
BTN_LEFT_SHLDR: C7.2 R8.1 ; port USER INTERFACE.BTN_LEFT_SHLDR
BTN_RIGHT: C11.2 R15.1 ; port USER INTERFACE.BTN_RIGHT
BTN_RIGHT_SEL: C6.2 R5.1 ; port USER INTERFACE.BTN_RIGHT_SEL
BTN_RIGHT_SHLDR: C8.2 R9.1 ; port USER INTERFACE.BTN_RIGHT_SHLDR
BTN_TOP: C9.2 R11.1 ; port USER INTERFACE.BTN_TOP
JOYSTICK_X: S8.X(S) U16.4(AIN0)
JOYSTICK_Y: S8.Y(S) U16.5(AIN1)
SCL: U16.10(SCL) ; port I2C.SCL  [project net FMC_SCL]
SDA: U16.9(SDA) ; port I2C.SDA  [project net FMC_SDA]
NetJ3_3: J3.3 U16.6(AIN2)
NetJ3_4: J3.4 U16.7(AIN3)
NetR2_2: R2.2 R4.2 S1.1(A)
NetR3_2: R3.2 R5.2 S2.1(A)
NetR6_2: R6.2 R8.2 S3.1(A)
NetR7_2: R7.2 R9.2 S4.1(A)
NetR10_2: R10.2 R11.2 S5.1(A)
NetR12_2: R12.2 R14.2 S6.1(A)
NetR13_2: R13.2 R15.2 S7.1(A)
NetR16_2: R16.2 R17.2 S9.1(A)

Not connected (* = marked no-connect by the designer): S1 2(A')* 3(B)*; S2 2(A')* 3(B)*; S5 2(A')* 3(B)*; S6 2(A')* 3(B)*; S7 2(A')* 3(B)*; S9 2(A')* 3(B)*

### Notes on the sheet
- What voltage do I need?
- Project:
- http://www.cospandesign.com
- Cospan Design
- Document:
- Engineer:
- Title:
- Client:
- Approved By:
- Revision:
- Date:
- Number:
- of

### Library data of the parts
C5-C12 C28 = C_0402_0.1UF_16V: as C1 on sheet Arduino and PMOD Connectors; Supplier 1: Digi-Key; RoHS: RoHS Compliant; Category: Capacitors; Stock 1: 18103134; Pricing 1: 1=0.1, 10=0.014, 100=0.0062, 500=0.00442, 1000=0.00348, 2500=0.00316, 5000=0.00291 (USD); Packaging: Cut Tape (CT); Part Status: Active; Operating Temperature: -55°C ~ 125°C; Features: -; Ratings: -; Applications: General Purpose; Mounting Type: Surface Mount, MLCC; Size / Dimension: 0.039" L x 0.020" W (1.00mm x 0.50mm); Height - Seated (Max): -; Thickness (Max): 0.022" (0.55mm); Lead Spacing: -; ComponentLink1URL: http://www.murata.com/~/media/webrenewal/support/library/catalog/products/capacitor/mlcc/c02e.ashx?la=en-us; ComponentLink1Description: http://www.murata.com/~/media/webrenewal/support/library/catalog/products/capacitor/mlcc/c02e.ashx?la=en-us; Supplier Part Number 1: 490-6328-1-ND
J3 = J_HDR1X4_THRHOLE_VERT_FEMALE: CONN HEADER .100" 4POS TIN PCB; Manufacturer: Samtec Inc; Manufacturer Part Number: SSW-116-01-T-S; Connector Type: Receptacle; Number of Positions: 16; Number of Positions Loaded: All; Supplier 1: Digi-Key; Supplier Part Number 1: SAM1213-16-ND; RoHS: RoHS Compliant; Category: Connectors, Interconnects; Stock 1: 0; Pricing: 1=1.65, 10=1.476, 100=1.2158, 500=0.96106, 1000=0.825, 5000=0.75264, 10000=0.72369 (USD); Contact Type: Female Socket; Number of Rows: 1; Row Spacing: -; Termination: Solder; Fastening Type: -; Features: -; Contact Finish: Tin; Contact Finish Thickness: -; Color: Black; Packaging: Bulk; ComponentLink1URL: http://www.samtec.com/documents/webfiles/cpdf/SSW-1XX-XX-XXX-X-XX-XXX-XX-MKT.pdf; ComponentLink1Description: http://www.samtec.com/documents/webfiles/cpdf/SSW-1XX-XX-XXX-X-XX-XXX-XX-MKT.pdf
R2 R3 R6 R7 R10 R12 R13 R16 = R_0402_100K: RES SMD 100K OHM 1% 1/16W 0402; Manufacturer: Yageo; Manufacturer Part Number: RC0402FR-07100KL; Temperature Coefficient: ±100ppm/°C; Supplier 1: Digi-Key; RoHS: RoHS Compliant; Category: Resistors; Stock 1: 4989982; Pricing 1: 1=0.1, 10=0.013, 25=0.0096, 100=0.0054, 250=0.00412, 500=0.00328, 1000=0.00242, 2500=0.0021, 5000=0.00173 (USD); Packaging: Cut Tape (CT); Resistance (Ohms): 100k; Composition: Thick Film; Features: Moisture Resistant; Operating Temperature: -55°C ~ 155°C; Package / Case: 0402 (1005 Metric); Supplier Device Package: 0402; Size / Dimension: 0.039" L x 0.020" W (1.00mm x 0.50mm); Height: 0.016" (0.40mm); Number of Terminations: 2; ComponentLink1URL: http://www.yageo.com/NewPortal/yageodocoutput?fileName=/pdf/R-Chip/PYu-RC_Group_51_RoHS_L_3.pdf; ComponentLink1Description: http://www.yageo.com/NewPortal/yageodocoutput?fileName=/pdf/R-Chip/PYu-RC_Group_51_RoHS_L_3.pdf; Supplier Part Number 1: 311-100KLRCT-ND
R4 R5 R8 R9 R11 R14 R15 R17 = R_0402_10.0K: as R1 on sheet Block Diagram; Supplier 1: Digi-Key; Supplier Part Number 1: RMCF0402FT10K0CT-ND; RoHS: RoHS Compliant; Category: Resistors; Stock 1: 234525; Pricing: 1=0.04, 10=0.025, 50=0.0138, 100=0.0105, 250=0.0078, 500=0.00576, 1000=0.00384, 2500=0.00324, 5000=0.0027 (USD); Composition: Thick Film; Features: -; Package / Case: 0402 (1005 Metric); Size / Dimension: 0.039" L x 0.020" W (1.00mm x 0.50mm); Height: 0.016" (0.40mm); Number of Terminations: 2; Packaging: Cut Tape (CT); ComponentLink1URL: http://www.seielect.com/Catalog/SEI-RMCF_RMCP.pdf; ComponentLink1Description: http://www.seielect.com/Catalog/SEI-RMCF_RMCP.pdf
S1 S2 S5-S7 S9 = S_TACTILE_1571563_2_BUTTON: SWITCH TACTILE SPST-NO 0.05A 24V; Mechanical Life: 1000000Cycles; Actuator Material: Nylon,Polyamide; Illumination Type: Non-Illuminated; Throw Configuration: SPST; Switch Travel: 0.25mm; Supplier 1: Digikey; Stock 1: 4653; Pricing 1: 1=0.68, 10=0.655, 25=0.6428, 50=0.6184, 100=0.5335, 500=0.4607, 1000=0.3637, 1200=0.3066 (USD); Min Operating Temperature: -35°C; Max Operating Temperature: 85°C; Package Quantity: 4800; Packaging: Tape and Reel; Supplier Part Number 1: 450-2057-1-ND
S3 S4 = S_TACTILE_ RA_TL3330AF130QG_BUTTON: SWITCH TACTILE SPST-NO 0.05A 12V; Mechanical Life: 50000Cycles; Actuator Material: Nylon,Polyamide; Throw Configuration: SPST; Contact Resistance: 100mR; Current Rating: 50mA; Illumination Type: Non-Illuminated,Illuminated; Switch Travel: 0.25mm; Actuator Length: 1mm; Supplier 1: Digikey; Stock 1: 47904; Pricing 1: 1=0.47, 10=0.448, 25=0.44, 50=0.4236, 100=0.3654, 250=0.3322, 500=0.3156, 1000=0.2492 (USD); Mount: Surface Mount; Case/Package: SMD/SMT; Contact Material: Silver; Colour: Black; Contact Plating: Silver; Min Operating Temperature: -30°C; Max Operating Temperature: 70°C; Package Quantity: 1; Packaging: Tape and Reel; Voltage Rating (DC): 12V; Max Voltage Rating (DC): 12V; Termination: Gull Wing; Electrical Life: 50000Cycles; REACH SVHC: No SVHC; Lead Free: Lead Free; ComponentLink1URL: https://datasheet.ciiva.com/2900/p010950-2900785.pdf; ComponentLink1Description: https://datasheet.ciiva.com/2900/p010950-2900785.pdf; ComponentLink2URL: https://datasheet.ciiva.com/2900/p010950-2900786.pdf; ComponentLink2Description: https://datasheet.ciiva.com/2900/p010950-2900786.pdf; ComponentLink3URL: https://datasheet.ciiva.com/2900/p010950-2900787.pdf; ComponentLink3Description: https://datasheet.ciiva.com/2900/p010950-2900787.pdf; ComponentLink4URL: https://datasheet.ciiva.com/23713/tl3330-23713381.pdf; ComponentLink4Description: https://datasheet.ciiva.com/23713/tl3330-23713381.pdf; Supplier Part Number 1: EG4388CT-ND; Manufacturer Part Number: TL3330AF130QG
S8 = S_JOYSTICK_ANALOG_XY: Resistance: 10KR; Supplier 1: Digikey; Stock 1: 0; Pricing 1: 1=2.5, 10=2.25 (USD); Packaging: Bulk; Length: 0.707inch; Height: 0.472inch; Width: 0.697inch; Supplier Part Number 1: 1528-1730-ND
U16 = U_TI-ADS1015_1115-10: IC ADC 12BIT I2C W/REF 10-MSOP; Number of Inputs: 2, 4; Input Type: Differential, Single Ended; Configuration: MUX-PGA-ADC; Ratio - S/H:ADC: 1:1; Number of A/D Converters: 1; Architecture: Sigma-Delta; Reference Type: Internal; Voltage - Supply, Analog: 2 V ~ 5.5 V; Supplier 1: Digi-Key; RoHS: RoHS Compliant; Category: Integrated Circuits (ICs); Stock 1: 1516; Pricing 1: 1=3.42, 10=3.065, 25=2.756, 100=2.5067 (USD); Packaging: Cut Tape (CT); Voltage - Supply, Digital: 2 V ~ 5.5 V; Features: PGA; Operating Temperature: -40°C ~ 125°C; Package / Case: 10-TFSOP, 10-MSOP (0.118", 3.00mm Width); ComponentLink1URL: http://www.ti.com/lit/ds/symlink/ads1013.pdf; ComponentLink1Description: http://www.ti.com/lit/ds/symlink/ads1013.pdf; Supplier Part Number 1: 296-25227-1-ND

## Sheet Snickerdoodle.SchDoc: Snickerdoodle Top
size Tabloid; ApprovedBy: NA; CompanyName: Cospan Design LLC; DrawnBy: Dave McCoy; Engineer: Dave McCoy; DocumentNumber: 2; Revision: A; SheetNumber: 2; SheetTotal: 20; Client: Public; Project: Enigma; ProjectPrettyName: Enigma
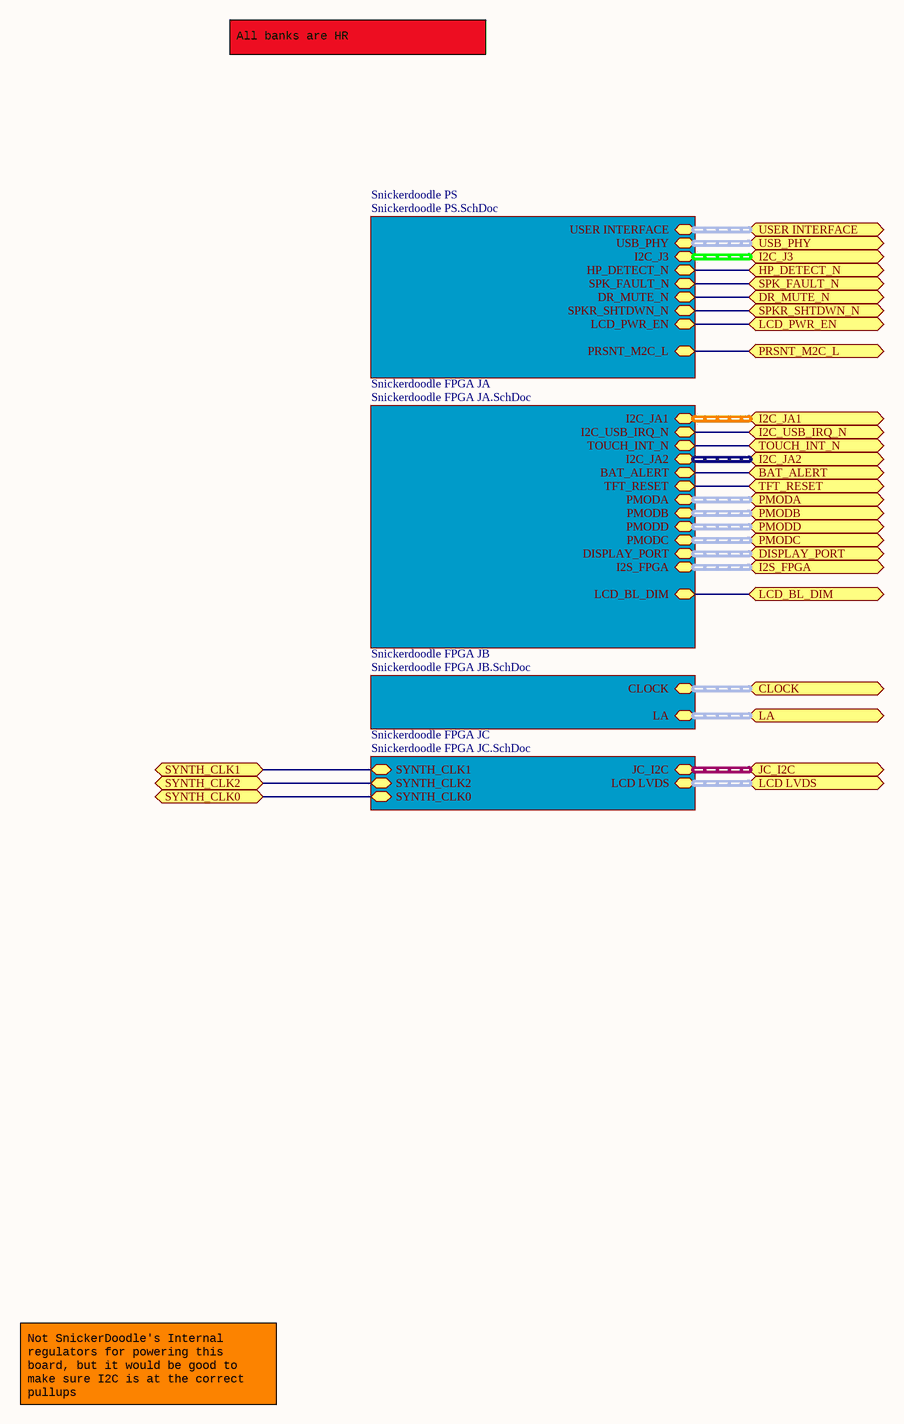
[diagram p3: Snickerdoodle.SchDoc]

### Sub-sheets
Snickerdoodle FPGA JA = Snickerdoodle FPGA JA.SchDoc: I2C_USB_IRQ_N, BAT_ALERT, PMODA (harness PMOD_Harness), PMODB (harness PMOD_Harness), PMODD (harness PMOD_Harness), PMODC (harness PMOD_Harness), DISPLAY_PORT (harness Display Port), I2S_FPGA (harness I2S Harness), TFT_RESET, TOUCH_INT_N, LCD_BL_DIM, I2C_JA2 (harness I2C Harness), I2C_JA1 (harness I2C Harness)
Snickerdoodle FPGA JB = Snickerdoodle FPGA JB.SchDoc: CLOCK (harness FMC_J1_CLOCK), LA (harness FMC_J1_LA)
Snickerdoodle FPGA JC = Snickerdoodle FPGA JC.SchDoc: JC_I2C (harness I2C Harness), SYNTH_CLK1, SYNTH_CLK2, SYNTH_CLK0, LCD LVDS (harness LCD Harness)
Snickerdoodle PS = Snickerdoodle PS.SchDoc: USER INTERFACE (harness User Interface Harness), USB_PHY (harness USB Phy Harness), I2C_J3 (harness I2C Harness), HP_DETECT_N, SPK_FAULT_N, DR_MUTE_N, SPKR_SHTDWN_N, LCD_PWR_EN, PRSNT_M2C_L

### Ports
BAT_ALERT, CLOCK (harness FMC_J1_CLOCK), DISPLAY_PORT (harness Display Port), DR_MUTE_N, HP_DETECT_N, I2C_J3 (harness I2C Harness), I2C_JA1 (harness I2C Harness), I2C_JA2 (harness I2C Harness), I2C_USB_IRQ_N, I2S_FPGA (harness I2S Harness), JC_I2C (harness I2C Harness), LA (harness FMC_J1_LA), LCD LVDS (harness LCD Harness), LCD_BL_DIM, LCD_PWR_EN, PMODA (harness PMOD_Harness), PMODB (harness PMOD_Harness), PMODC (harness PMOD_Harness), PMODD (harness PMOD_Harness), PRSNT_M2C_L, SPK_FAULT_N, SPKR_SHTDWN_N, SYNTH_CLK0, SYNTH_CLK1, SYNTH_CLK2, TFT_RESET, TOUCH_INT_N, USB_PHY (harness USB Phy Harness), USER INTERFACE (harness User Interface Harness)

### Nets
ALERT: port BAT_ALERT, sheet Snickerdoodle FPGA JA/BAT_ALERT
DR_MUTE_N: port DR_MUTE_N, sheet Snickerdoodle PS/DR_MUTE_N
HP_DETECT_N: port HP_DETECT_N, sheet Snickerdoodle PS/HP_DETECT_N
I2C_USB_IRQ_N: port I2C_USB_IRQ_N, sheet Snickerdoodle FPGA JA/I2C_USB_IRQ_N
LCD_BL_DIM: port LCD_BL_DIM, sheet Snickerdoodle FPGA JA/LCD_BL_DIM
LCD_PWR_EN: port LCD_PWR_EN, sheet Snickerdoodle PS/LCD_PWR_EN
PRSNT_M2C_L: port PRSNT_M2C_L, sheet Snickerdoodle PS/PRSNT_M2C_L
SPK_FAULT_N: port SPK_FAULT_N, sheet Snickerdoodle PS/SPK_FAULT_N
SPKR_SHTDWN_N: port SPKR_SHTDWN_N, sheet Snickerdoodle PS/SPKR_SHTDWN_N
SYNTH_CLK0: port SYNTH_CLK0, sheet Snickerdoodle FPGA JC/SYNTH_CLK0
SYNTH_CLK1: port SYNTH_CLK1, sheet Snickerdoodle FPGA JC/SYNTH_CLK1
SYNTH_CLK2: port SYNTH_CLK2, sheet Snickerdoodle FPGA JC/SYNTH_CLK2
TFT_RESET: port TFT_RESET, sheet Snickerdoodle FPGA JA/TFT_RESET
TOUCH_INT_N: port TOUCH_INT_N, sheet Snickerdoodle FPGA JA/TOUCH_INT_N

### Buses and harness runs
harness port CLOCK = sheet Snickerdoodle FPGA JB/CLOCK
harness port DISPLAY_PORT = sheet Snickerdoodle FPGA JA/DISPLAY_PORT
harness port I2C_J3 = sheet Snickerdoodle PS/I2C_J3
harness port I2C_JA1 = sheet Snickerdoodle FPGA JA/I2C_JA1
harness port I2C_JA2 = sheet Snickerdoodle FPGA JA/I2C_JA2
harness port I2S_FPGA = sheet Snickerdoodle FPGA JA/I2S_FPGA
harness port JC_I2C = sheet Snickerdoodle FPGA JC/JC_I2C
harness port LA = sheet Snickerdoodle FPGA JB/LA
harness port LCD LVDS = sheet Snickerdoodle FPGA JC/LCD LVDS
harness port PMODA = sheet Snickerdoodle FPGA JA/PMODA
harness port PMODB = sheet Snickerdoodle FPGA JA/PMODB
harness port PMODC = sheet Snickerdoodle FPGA JA/PMODC
harness port PMODD = sheet Snickerdoodle FPGA JA/PMODD
harness port USB_PHY = sheet Snickerdoodle PS/USB_PHY
harness port USER INTERFACE = sheet Snickerdoodle PS/USER INTERFACE

### Notes on the sheet
- All banks are HR
- Not SnickerDoodle's Internal regulators for powering this board, but it would be good to make sure I2C is at the correct pullups
- Project:
- http://www.cospandesign.com
- Cospan Design
- Document:
- Engineer:
- Title:
- Client:
- Approved By:
- Revision:
- Date:
- Number:
- of

## Sheet Snickerdoodle PS.SchDoc: Snickerdoodle PS
size Tabloid; ApprovedBy: NA; CompanyName: Cospan Design LLC; DrawnBy: Dave McCoy; Engineer: Dave McCoy; DocumentNumber: 3; Revision: A; SheetNumber: 3; SheetTotal: 20; Client: Public; Project: Enigma; ProjectPrettyName: Enigma
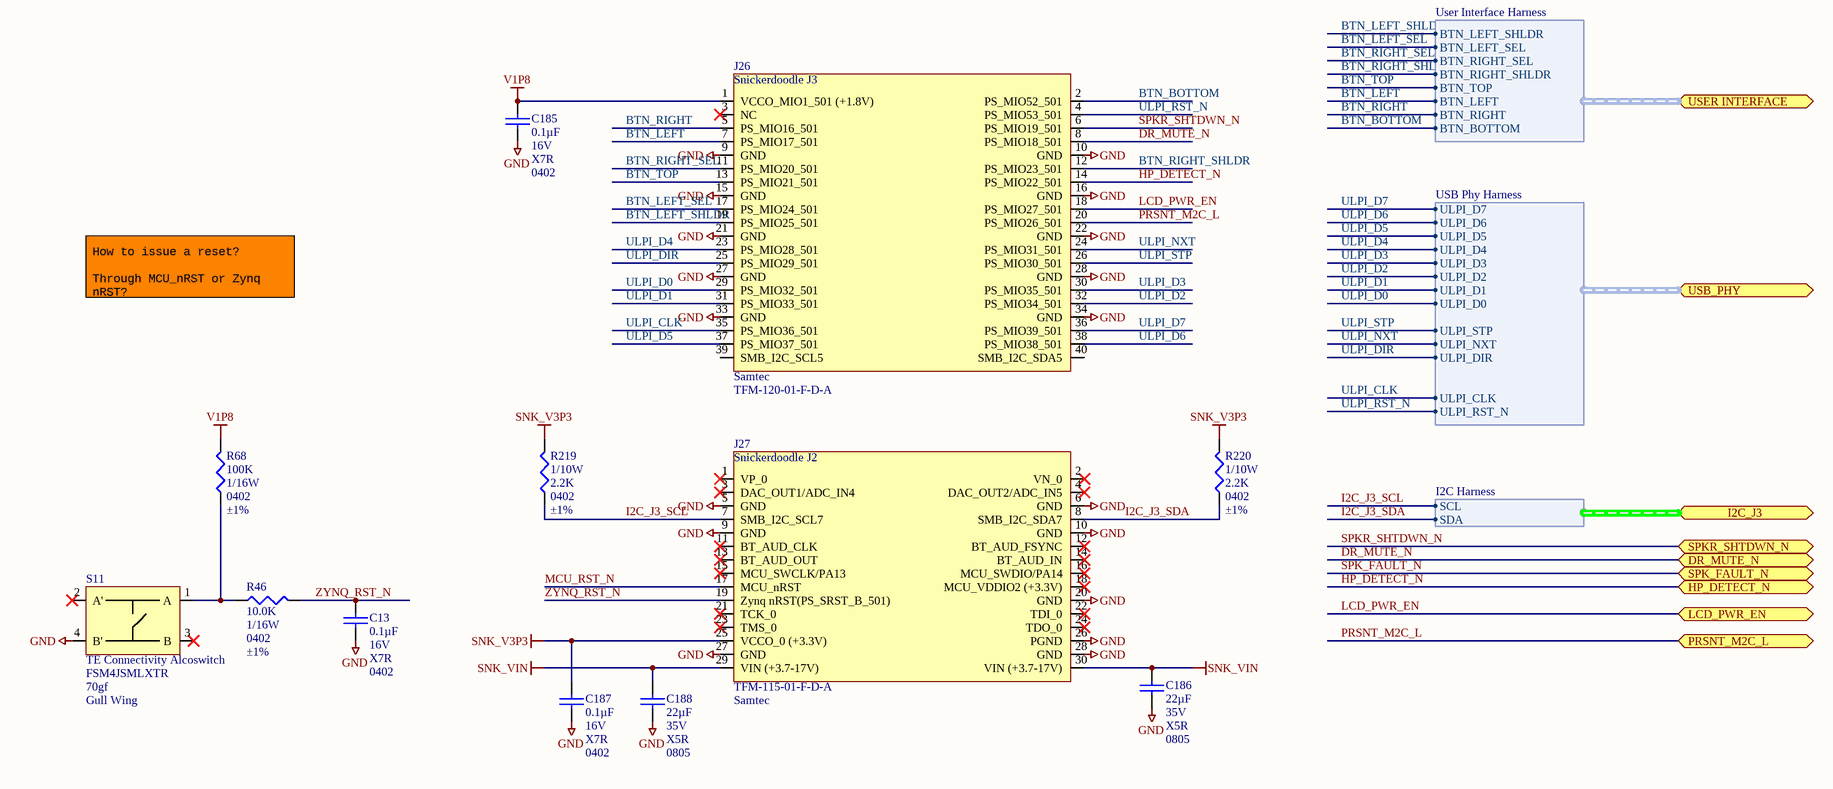
[diagram p4: Snickerdoodle PS.SchDoc]

### Parts
C13  Capacitance: 0.1µF  Voltage - Rated: 16V  Temperature Coefficient: X7R  Package / Case: 0402  [C_0402]  (hidden comment: 0.1uF)
C185  Capacitance: 0.1µF  Voltage - Rated: 16V  Temperature Coefficient: X7R  Package / Case: 0402  [C_0402]  (hidden comment: 0.1uF)
C186  Capacitance: 22µF  Voltage - Rated: 35V  Temperature Coefficient: X5R  Package / Case: 0805  [C_ERA-0805]  (hidden comment: C_0805_22µF_35V)
C187  Capacitance: 0.1µF  Voltage - Rated: 16V  Temperature Coefficient: X7R  Package / Case: 0402  [C_0402]  (hidden comment: 0.1uF)
C188  Capacitance: 22µF  Voltage - Rated: 35V  Temperature Coefficient: X5R  Package / Case: 0805  [C_ERA-0805]  (hidden comment: C_0805_22µF_35V)
J26  Manufacturer: Samtec  Manufacturer Part Number: TFM-120-01-F-D-A  [TFM12001-X-D-A]  (hidden comment: J_SNICKERDOODLE_J3)
J27  Manufacturer Part Number: TFM-115-01-F-D-A  Manufacturer: Samtec  [TFM11501-X-D-A]  (hidden comment: J_SNICKERDOODLE_J2)
R46  Resistance In Ohms: 10.0K  Power (Watts): 1/16W  Case: 0402  Tolerance: ±1%  [R_0402]  (hidden comment: R_0402_10.0K)
R68  Resistance In Ohms: 100K  Power (Watts): 1/16W  Case: 0402  Tolerance: ±1%  [R_0402]  (hidden comment: R_0402_100K)
R219  Power (Watts): 1/10W  Resistance In Ohms: 2.2K  Case: 0402  Tolerance: ±1%  [R_0402]  (hidden comment: 2.2k Ohms)
R220  Power (Watts): 1/10W  Resistance In Ohms: 2.2K  Case: 0402  Tolerance: ±1%  [R_0402]  (hidden comment: 2.2k Ohms)
S11  Manufacturer: TE Connectivity Alcoswitch  Manufacturer Part Number: FSM4JSMLXTR  Operating Force: 70gf  Termination: Gull Wing  [TACTILE_1571563_2]  (hidden comment: S_TACTILE_1571563_2_BUTTON)

### Ports
DR_MUTE_N, HP_DETECT_N, I2C_J3 (harness I2C Harness), LCD_PWR_EN, PRSNT_M2C_L, SPK_FAULT_N, SPKR_SHTDWN_N, USB_PHY (harness USB Phy Harness), USER INTERFACE (harness User Interface Harness)

### Harnesses
User Interface Harness: BTN_LEFT_SHLDR, BTN_LEFT_SEL, BTN_RIGHT_SEL, BTN_TOP, BTN_LEFT, BTN_RIGHT, BTN_BOTTOM, BTN_RIGHT_SHLDR
USB Phy Harness: ULPI_D7, ULPI_D6, ULPI_D5, ULPI_D4, ULPI_D3, ULPI_D2, ULPI_D1, ULPI_D0, ULPI_STP, ULPI_NXT, ULPI_DIR, ULPI_CLK, ULPI_RST_N
I2C Harness: SCL, SDA

### Nets
GND: C13.1 C185.1 C186.1 C187.1 C188.1 J26.9(GND) J26.10(GND) J26.15(GND) J26.16(GND) J26.21(GND) J26.22(GND) J26.27(GND) J26.28(GND) J26.33(GND) J26.34(GND) J27.5(GND) J27.6(GND) J27.9(GND) J27.10(GND) J27.20(GND) J27.26(PGND) J27.27(GND) J27.28(GND) S11.4(B')
SNK_V3P3: C187.2 J27.25(VCCO_0_(+3.3V)) R219.1 R220.1
SNK_VIN: C186.2 C188.2 J27.29(VIN_(+3.7-17V)) J27.30(VIN_(+3.7-17V))
V1P8: C185.2 J26.1(VCCO_MIO1_501_(+1.8V)) R68.1
BTN_BOTTOM: J26.2(PS_MIO52_501) ; port USER INTERFACE.BTN_BOTTOM
BTN_LEFT: J26.7(PS_MIO17_501) ; port USER INTERFACE.BTN_LEFT
BTN_LEFT_SEL: J26.17(PS_MIO24_501) ; port USER INTERFACE.BTN_LEFT_SEL
BTN_LEFT_SHLDR: J26.19(PS_MIO25_501) ; port USER INTERFACE.BTN_LEFT_SHLDR
BTN_RIGHT: J26.5(PS_MIO16_501) ; port USER INTERFACE.BTN_RIGHT
BTN_RIGHT_SEL: J26.11(PS_MIO20_501) ; port USER INTERFACE.BTN_RIGHT_SEL
BTN_RIGHT_SHLDR: J26.12(PS_MIO23_501) ; port USER INTERFACE.BTN_RIGHT_SHLDR
BTN_TOP: J26.13(PS_MIO21_501) ; port USER INTERFACE.BTN_TOP
DR_MUTE_N: J26.8(PS_MIO18_501) ; port DR_MUTE_N
HP_DETECT_N: J26.14(PS_MIO22_501) ; port HP_DETECT_N
I2C_J3_SCL: J27.7(SMB_I2C_SCL7) R219.2 ; port I2C_J3.SCL  [project net FMC_SCL]
I2C_J3_SDA: J27.8(SMB_I2C_SDA7) R220.2 ; port I2C_J3.SDA  [project net FMC_SDA]
LCD_PWR_EN: J26.18(PS_MIO27_501) ; port LCD_PWR_EN
MCU_RST_N: J27.17(MCU_nRST)
PRSNT_M2C_L: J26.20(PS_MIO26_501) ; port PRSNT_M2C_L
SPKR_SHTDWN_N: J26.6(PS_MIO19_501) ; port SPKR_SHTDWN_N
ULPI_CLK: J26.35(PS_MIO36_501) ; port USB_PHY.ULPI_CLK
ULPI_D0: J26.29(PS_MIO32_501) ; port USB_PHY.ULPI_D0
ULPI_D1: J26.31(PS_MIO33_501) ; port USB_PHY.ULPI_D1
ULPI_D2: J26.32(PS_MIO34_501) ; port USB_PHY.ULPI_D2
ULPI_D3: J26.30(PS_MIO35_501) ; port USB_PHY.ULPI_D3
ULPI_D4: J26.23(PS_MIO28_501) ; port USB_PHY.ULPI_D4
ULPI_D5: J26.37(PS_MIO37_501) ; port USB_PHY.ULPI_D5
ULPI_D6: J26.38(PS_MIO38_501) ; port USB_PHY.ULPI_D6
ULPI_D7: J26.36(PS_MIO39_501) ; port USB_PHY.ULPI_D7
ULPI_DIR: J26.25(PS_MIO29_501) ; port USB_PHY.ULPI_DIR
ULPI_NXT: J26.24(PS_MIO31_501) ; port USB_PHY.ULPI_NXT
ULPI_RST_N: J26.4(PS_MIO53_501) ; port USB_PHY.ULPI_RST_N
ULPI_STP: J26.26(PS_MIO30_501) ; port USB_PHY.ULPI_STP
ZYNQ_RST_N: C13.2 J27.19(Zynq_nRST(PS_SRST_B_501)) R46.1
NetR46_2: R46.2 R68.2 S11.1(A)

Not connected (* = marked no-connect by the designer): J26 3(NC)* 39(SMB_I2C_SCL5) 40(SMB_I2C_SDA5); J27 1(VP_0)* 2(VN_0)* 3(DAC_OUT1/ADC_IN4)* 4(DAC_OUT2/ADC_IN5)* 11(BT_AUD_CLK)* 12(BT_AUD_FSYNC)* 13(BT_AUD_OUT)* 14(BT_AUD_IN)* 15(MCU_SWCLK/PA13)* 16(MCU_SWDIO/PA14)* 18(MCU_VDDIO2_(+3.3V))* 21(TCK_0)* 22(TDI_0)* 23(TMS_0)* 24(TDO_0)*; S11 2(A')* 3(B)*

### Notes on the sheet
- How to issue a reset?
  Through MCU_nRST or Zynq nRST?
- Project:
- http://www.cospandesign.com
- Cospan Design
- Document:
- Engineer:
- Title:
- Client:
- Approved By:
- Revision:
- Date:
- Number:
- of
- (in symbol J_SNICKERDOODLE_J2) Snickerdoodle J2
- (in symbol J_SNICKERDOODLE_J3) Snickerdoodle J3

### Library data of the parts
C13 C185 C187 = C_0402_0.1UF_16V: as C1 on sheet Arduino and PMOD Connectors; Supplier 1: Digi-Key; Supplier Part Number 1: 490-6328-1-ND; RoHS: RoHS Compliant; Category: Capacitors; Stock 1: 18103134; Mounting Type: Surface Mount, MLCC; Features: -; Lead Spacing: -; Packaging: Cut Tape (CT); ComponentLink1URL: http://www.murata.com/~/media/webrenewal/support/library/catalog/products/capacitor/mlcc/c02e.ashx?la=en-us; ComponentLink1Description: http://www.murata.com/~/media/webrenewal/support/library/catalog/products/capacitor/mlcc/c02e.ashx?la=en-us; Operating Temperature: -55°C ~ 125°C; Pricing 1: 1=0.1, 10=0.014, 100=0.0062, 500=0.00442, 1000=0.00348, 2500=0.00316, 5000=0.00291 (USD); Part Status: Active; Ratings: -; Applications: General Purpose; Size / Dimension: 0.039" L x 0.020" W (1.00mm x 0.50mm); Height - Seated (Max): -; Thickness (Max): 0.022" (0.55mm)
C186 C188 = C_0805_22µF_35V: CAP CER 22UF 35V X5R 0805; Manufacturer: TDK Corporation; Manufacturer Part Number: C2012X5R1V226M125AC; Tolerance: ±20%; Supplier 1: Digi-Key; RoHS: RoHS Compliant; Category: Capacitors; Stock 1: 3681; Pricing 1: 1=1.14, 10=0.863, 100=0.6176, 500=0.47818, 1000=0.41176 (USD); Packaging: Cut Tape (CT); Mounting Type: Surface Mount, MLCC; Operating Temperature: -55°C ~ 85°C; Applications: General Purpose; Ratings: -; Size / Dimension: 0.079" L x 0.049" W (2.00mm x 1.25mm); Height - Seated (Max): -; Thickness (Max): 0.057" (1.45mm); Lead Spacing: -; Features: Low ESL; Lead Style: -; ComponentLink1URL: https://product.tdk.com/info/en/catalog/datasheets/mlcc_commercial_general_en.pdf; ComponentLink1Description: https://product.tdk.com/info/en/catalog/datasheets/mlcc_commercial_general_en.pdf; Supplier Part Number 1: 445-14428-1-ND; Part Status: Active; Failure Rate: -
J26 = J_SNICKERDOODLE_J3: SNICKERDOODLE J3
J27 = J_SNICKERDOODLE_J2: SNICKERDOODLE J2
R46 = R_0402_10.0K: as R1 on sheet Block Diagram; Supplier 1: Digi-Key; Supplier Part Number 1: RMCF0402FT10K0CT-ND; RoHS: RoHS Compliant; Category: Resistors; Stock 1: 234525; Pricing: 1=0.04, 10=0.025, 50=0.0138, 100=0.0105, 250=0.0078, 500=0.00576, 1000=0.00384, 2500=0.00324, 5000=0.0027 (USD); Composition: Thick Film; Features: -; Package / Case: 0402 (1005 Metric); Size / Dimension: 0.039" L x 0.020" W (1.00mm x 0.50mm); Height: 0.016" (0.40mm); Number of Terminations: 2; Packaging: Cut Tape (CT); ComponentLink1URL: http://www.seielect.com/Catalog/SEI-RMCF_RMCP.pdf; ComponentLink1Description: http://www.seielect.com/Catalog/SEI-RMCF_RMCP.pdf
R68 = R_0402_100K: as R2 on sheet User Interface; Supplier 1: Digi-Key; RoHS: RoHS Compliant; Category: Resistors; Stock 1: 4989982; Pricing 1: 1=0.1, 10=0.013, 25=0.0096, 100=0.0054, 250=0.00412, 500=0.00328, 1000=0.00242, 2500=0.0021, 5000=0.00173 (USD); Packaging: Cut Tape (CT); Resistance (Ohms): 100k; Composition: Thick Film; Features: Moisture Resistant; Operating Temperature: -55°C ~ 155°C; Package / Case: 0402 (1005 Metric); Supplier Device Package: 0402; Size / Dimension: 0.039" L x 0.020" W (1.00mm x 0.50mm); Height: 0.016" (0.40mm); Number of Terminations: 2; ComponentLink1URL: http://www.yageo.com/NewPortal/yageodocoutput?fileName=/pdf/R-Chip/PYu-RC_Group_51_RoHS_L_3.pdf; ComponentLink1Description: http://www.yageo.com/NewPortal/yageodocoutput?fileName=/pdf/R-Chip/PYu-RC_Group_51_RoHS_L_3.pdf; Supplier Part Number 1: 311-100KLRCT-ND
R219 R220 = R_0402_2.2K: RES 2.20K OHM 1/10W 1% 0402 SMD; Manufacturer: Yageo; Manufacturer Part Number: RC0402FR-072K2L; Temperature Coefficient: ±100ppm/°C; Supplier 1: Digi-Key; Supplier Part Number 1: 311-2.20KLRCT-ND; RoHS: RoHS Compliant; Category: Resistors; Stock 1: 0; Pricing: 10=0.014, 100=0.0063, 500=0.00382, 1000=0.0027, 5000=0.00203 (USD); Resistance (Ohms): 2.2K; Composition: Thick Film; Features: -; Package / Case: 0402 (1005 Metric); Size / Dimension: 0.039" L x 0.020" W (1.00mm x 0.50mm); Height: 0.016" (0.40mm); Number of Terminations: 2; Packaging: Cut Tape (CT); ComponentLink1URL: http://www.yageo.com/documents/recent/PYu-RC0402_51_RoHS_L_6.pdf; ComponentLink1Description: http://www.yageo.com/documents/recent/PYu-RC0402_51_RoHS_L_6.pdf; Supplier 2: Digi-Key; Supplier Part Number 2: RMCF0402FT2K20CT-ND; Stock 2: 39712; ComponentLink2URL: http://www.seielect.com/Catalog/SEI-RMCF_RMCP.pdf; ComponentLink2Description: http://www.seielect.com/Catalog/SEI-RMCF_RMCP.pdf
S11 = S_TACTILE_1571563_2_BUTTON: as S1 on sheet User Interface; Supplier 1: Digikey; Stock 1: 4653; Pricing 1: 1=0.68, 10=0.655, 25=0.6428, 50=0.6184, 100=0.5335, 500=0.4607, 1000=0.3637, 1200=0.3066 (USD); Min Operating Temperature: -35°C; Max Operating Temperature: 85°C; Package Quantity: 4800; Packaging: Tape and Reel; Supplier Part Number 1: 450-2057-1-ND